# Altium project COMRAD_0v1.PrjPCB (part 3 of 5)

## Sheet Ethernet2_Power.SchDoc
size A4; DocumentNumber: 19; SheetNumber: 19; SheetTotal: 47
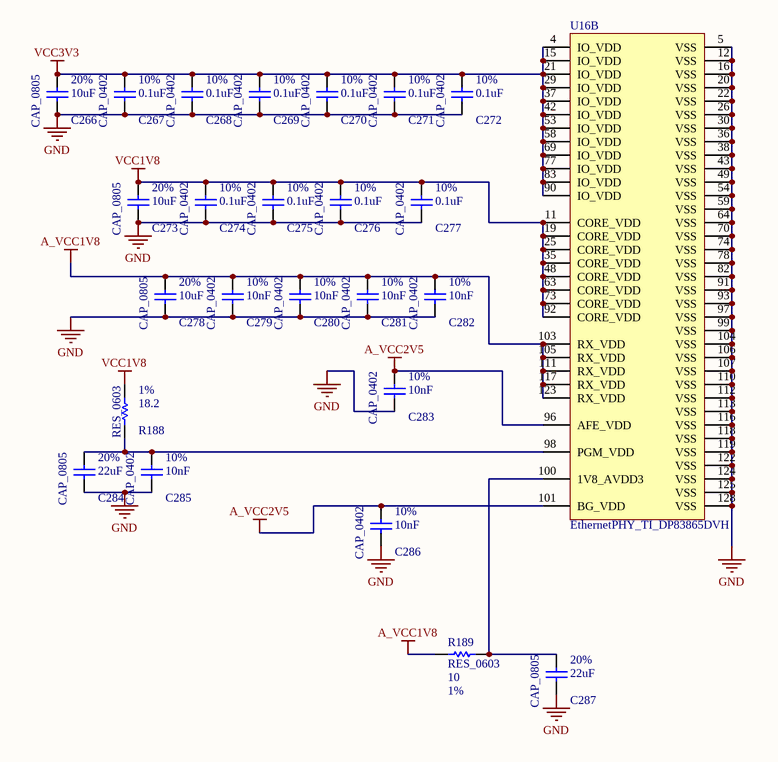
[diagram p17: Ethernet2_Power.SchDoc]

### Parts
C266  CAP_0805  value 10uF  Tolerance: 20%  [CAPC0805(2012)75_N]
C267  CAP_0402  value 0.1uF  Tolerance: 10%  [CAPC0402(1005)60_N]
C268  CAP_0402  value 0.1uF  Tolerance: 10%  [CAPC0402(1005)60_N]
C269  CAP_0402  value 0.1uF  Tolerance: 10%  [CAPC0402(1005)60_N]
C270  CAP_0402  value 0.1uF  Tolerance: 10%  [CAPC0402(1005)60_N]
C271  CAP_0402  value 0.1uF  Tolerance: 10%  [CAPC0402(1005)60_N]
C272  CAP_0402  value 0.1uF  Tolerance: 10%  [CAPC0402(1005)60_N]
C273  CAP_0805  value 10uF  Tolerance: 20%  [CAPC0805(2012)75_N]
C274  CAP_0402  value 0.1uF  Tolerance: 10%  [CAPC0402(1005)60_N]
C275  CAP_0402  value 0.1uF  Tolerance: 10%  [CAPC0402(1005)60_N]
C276  CAP_0402  value 0.1uF  Tolerance: 10%  [CAPC0402(1005)60_N]
C277  CAP_0402  value 0.1uF  Tolerance: 10%  [CAPC0402(1005)60_N]
C278  CAP_0805  value 10uF  Tolerance: 20%  [CAPC0805(2012)75_N]
C279  CAP_0402  value 10nF  Tolerance: 10%  [CAPC0402(1005)60_N]
C280  CAP_0402  value 10nF  Tolerance: 10%  [CAPC0402(1005)60_N]
C281  CAP_0402  value 10nF  Tolerance: 10%  [CAPC0402(1005)60_N]
C282  CAP_0402  value 10nF  Tolerance: 10%  [CAPC0402(1005)60_N]
C283  CAP_0402  value 10nF  Tolerance: 10%  [CAPC0402(1005)60_N]
C284  CAP_0805  value 22uF  Tolerance: 20%  [CAPC0805(2012)75_N]
C285  CAP_0402  value 10nF  Tolerance: 10%  [CAPC0402(1005)60_N]
C286  CAP_0402  value 10nF  Tolerance: 10%  [CAPC0402(1005)60_N]
C287  CAP_0805  value 22uF  Tolerance: 20%  [CAPC0805(2012)75_N]
R188  RES_0603  value 18.2  Tolerance: 1%  [RESC0603(1608)_N]
R189  RES_0603  value 10  Tolerance: 1%  [RESC0603(1608)_N]
U16  EthernetPHY_TI_DP83865DVH  [EthernetPHY_TI_DP83865(PQFP)_VLA128A_N]  (part B of 2)

### Nets
A_VCC1V8: C273.2 C274.2 C275.2 C276.2 C277.2 C278.2 C279.2 C280.2 C281.2 C282.2 R188.2 R189.2 U16.11(CORE_VDD) U16.19(CORE_VDD) U16.25(CORE_VDD) U16.35(CORE_VDD) U16.48(CORE_VDD) U16.63(CORE_VDD) U16.73(CORE_VDD) U16.92(CORE_VDD) U16.103(RX_VDD) U16.105(RX_VDD) U16.111(RX_VDD) U16.117(RX_VDD) U16.123(RX_VDD)  [also labelled VCC1V8]
A_VCC2V5: C283.2 C286.2 U16.96(AFE_VDD) U16.101(BG_VDD)
GND: C266.1 C267.1 C268.1 C269.1 C270.1 C271.1 C272.1 C273.1 C274.1 C275.1 C276.1 C277.1 C278.1 C279.1 C280.1 C281.1 C282.1 C283.1 C284.1 C285.1 C286.1 C287.1 U16.5(VSS) U16.12(VSS) U16.16(VSS) U16.20(VSS) U16.22(VSS) U16.26(VSS) U16.30(VSS) U16.36(VSS) U16.38(VSS) U16.43(VSS) U16.49(VSS) U16.54(VSS) U16.59(VSS) U16.64(VSS) U16.70(VSS) U16.74(VSS) U16.78(VSS) U16.82(VSS) U16.91(VSS) U16.93(VSS) U16.97(VSS) U16.99(VSS) U16.104(VSS) U16.106(VSS) U16.107(VSS) U16.110(VSS) U16.112(VSS) U16.113(VSS) U16.116(VSS) U16.118(VSS) U16.119(VSS) U16.122(VSS) U16.124(VSS) U16.125(VSS) U16.128(VSS)
VCC3V3: C266.2 C267.2 C268.2 C269.2 C270.2 C271.2 C272.2 U16.4(IO_VDD) U16.15(IO_VDD) U16.21(IO_VDD) U16.29(IO_VDD) U16.37(IO_VDD) U16.42(IO_VDD) U16.53(IO_VDD) U16.58(IO_VDD) U16.69(IO_VDD) U16.77(IO_VDD) U16.83(IO_VDD) U16.90(IO_VDD)
NetC284_2: C284.2 C285.2 R188.1 U16.98(PGM_VDD)
NetC287_2: C287.2 R189.1 U16.100(1V8_AVDD3)

### Library data of the parts
C266 C273 C278 = ECJ-2FB0J106M: 10uF, ceramic, 20%, 6.3V, X5R 0805; Manufacturer: Panasonic - ECG; Part Number: ECJ-2FB0J106M; Footprint Ref: CAPC0805(2012)75_N; Library Ref: CAP_0805
C267-C272 C274-C277 = CAP_0402: as C241-C246 on sheet Ethernet1_Power; Footprint Ref: CAPC0402(1005)60_N; Library Ref: CAP_0402
C279-C283 C285 C286 = CAP_0402: as C253-C257 on sheet Ethernet1_Power; Footprint Ref: CAPC0402(1005)60_N; Library Ref: CAP_0402
C284 C287 = JMK212BJ226MG-T: 22uF, ceramic, 20%, 6.3V, X5R, 0805; Manufacturer: Taiyo Yuden; Part Number: JMK212BJ226MG-T; Footprint Ref: CAPC0805(2012)75_N; Library Ref: CAP_0805
R188 = ERJ-3EKF18R2V: RES 18.2 OHM 1/10W 1% 0603 SMD; Manufacturer: Panasonic Electronics Components; Part Number: ERJ-3EKF18R2V; Footprint Ref: RESC0603(1608)_N; Library Ref: RES_0603
R189 = ERJ-3EKF10R0V: RES 10.0 OHM 1/10W 1% 0603 SMD; Manufacturer: Panasonic Electronics Components; Part Number: ERJ-3EKF10R0V; Footprint Ref: RESC0603(1608)_N; Library Ref: RES_0603
U16 = DP83865DVH: Ethernet PHY_TI_DP83865DVH, Gigabit Ethernet PHYTER,128 Lead Plastic Flat Pack; Manufacturer: Texas Instruments; Part Number: DP83865DVH

## Sheet PERIPHERALS.SchDoc
size A4; DocumentNumber: 43; SheetNumber: 43; SheetTotal: 47
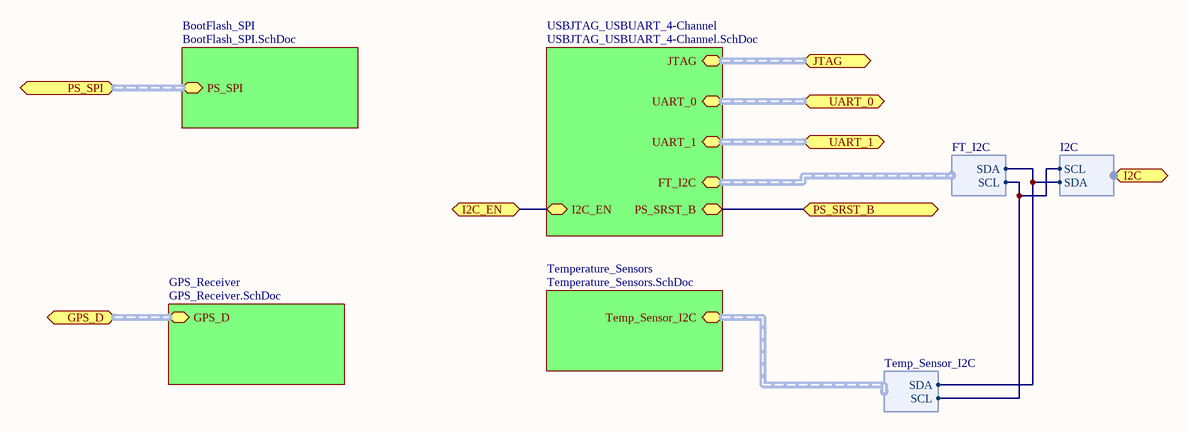
[diagram p18: PERIPHERALS.SchDoc]

### Sub-sheets
BootFlash_SPI = BootFlash_SPI.SchDoc: PS_SPI (harness SPI)
GPS_Receiver = GPS_Receiver.SchDoc: GPS_D (harness GPS)
Temperature_Sensors = Temperature_Sensors.SchDoc: Temp_Sensor_I2C (harness Temp_Sensor_I2C)
USBJTAG_USBUART_4-Channel = USBJTAG_USBUART_4-Channel.SchDoc: JTAG (harness JTAG), UART_0 (harness UART_0), UART_1 (harness UART_1), PS_SRST_B (bidir), FT_I2C (harness FT_I2C), I2C_EN

### Ports
GPS_D (harness GPS), I2C (harness I2C), I2C_EN (bidir), JTAG (harness JTAG), PS_SPI (harness SPI), PS_SRST_B (bidir), UART_0 (harness UART_0), UART_1 (harness UART_1)

### Harnesses
I2C: SCL, SDA
Temp_Sensor_I2C: SCL, SDA
FT_I2C: SCL, SDA

### Nets
I2C_EN: port I2C_EN, sheet USBJTAG_USBUART_4-Channel/I2C_EN
PS_SRST_B: port PS_SRST_B, sheet USBJTAG_USBUART_4-Channel/PS_SRST_B
NetJ10_5: port I2C.SDA, sheet Temperature_Sensors/Temp_Sensor_I2C.SDA, sheet USBJTAG_USBUART_4-Channel/FT_I2C.SDA
NetJ10_6: port I2C.SCL, sheet Temperature_Sensors/Temp_Sensor_I2C.SCL, sheet USBJTAG_USBUART_4-Channel/FT_I2C.SCL

### Buses and harness runs
harness port GPS_D = sheet GPS_Receiver/GPS_D
harness port JTAG = sheet USBJTAG_USBUART_4-Channel/JTAG
harness port PS_SPI = sheet BootFlash_SPI/PS_SPI
harness port UART_0 = sheet USBJTAG_USBUART_4-Channel/UART_0
harness port UART_1 = sheet USBJTAG_USBUART_4-Channel/UART_1

## Sheet BootFlash_SPI.SchDoc
size A4; DocumentNumber: 12; SheetNumber: 12; SheetTotal: 47
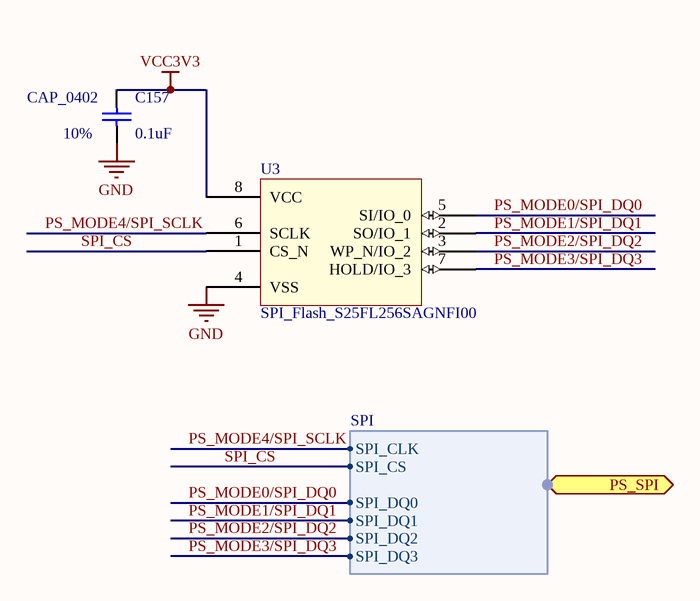
[diagram p19: BootFlash_SPI.SchDoc]

### Parts
C157  CAP_0402  value 0.1uF  Tolerance: 10%  [CAPC0402(1005)60_N]
U3  SPI_Flash_S25FL256SAGNFI00  [SPI_Flash_S25FL256SAGNFI00_WSON-8]

### Ports
PS_SPI (harness SPI)

### Harnesses
SPI: SPI_CLK, SPI_CS, SPI_DQ0, SPI_DQ1, SPI_DQ2, SPI_DQ3

### Nets
GND: C157.1 U3.4(VSS)
VCC3V3: C157.2 U3.8(VCC)
PS_MODE0/SPI_DQ0: U3.5(SI/IO_0) ; port PS_SPI.SPI_DQ0
PS_MODE1/SPI_DQ1: U3.2(SO/IO_1) ; port PS_SPI.SPI_DQ1
PS_MODE2/SPI_DQ2: U3.3(WP_N/IO_2) ; port PS_SPI.SPI_DQ2
PS_MODE3/SPI_DQ3: U3.7(HOLD/IO_3) ; port PS_SPI.SPI_DQ3
PS_MODE4/SPI_SCLK: U3.6(SCLK) ; port PS_SPI.SPI_CLK
SPI_CS: U3.1(CS_N) ; port PS_SPI.SPI_CS

### Library data of the parts
C157 = C1005X5R0J104K: 0.1uf, ceramic, 10%, 6.3V, X5R, 0402; Manufacturer: TDK Corporation; Part Number: C1005X5R0J104K; Footprint Ref: CAPC0402(1005)60_N; Library Ref: CAP_0402
U3 = S25FL256SAGNFI001: S25FL256SAGMFI00, Serial Flash Memory, 256Mbit, Low Voltage, 104MHz SPI Bus Interface, SOIC16 WIDE; Manufacturer: Spansion; Part Number: S25FL256SAGNFI001

## Sheet GPS_Receiver.SchDoc
size A4; DocumentNumber: 16; SheetNumber: 16; SheetTotal: 47
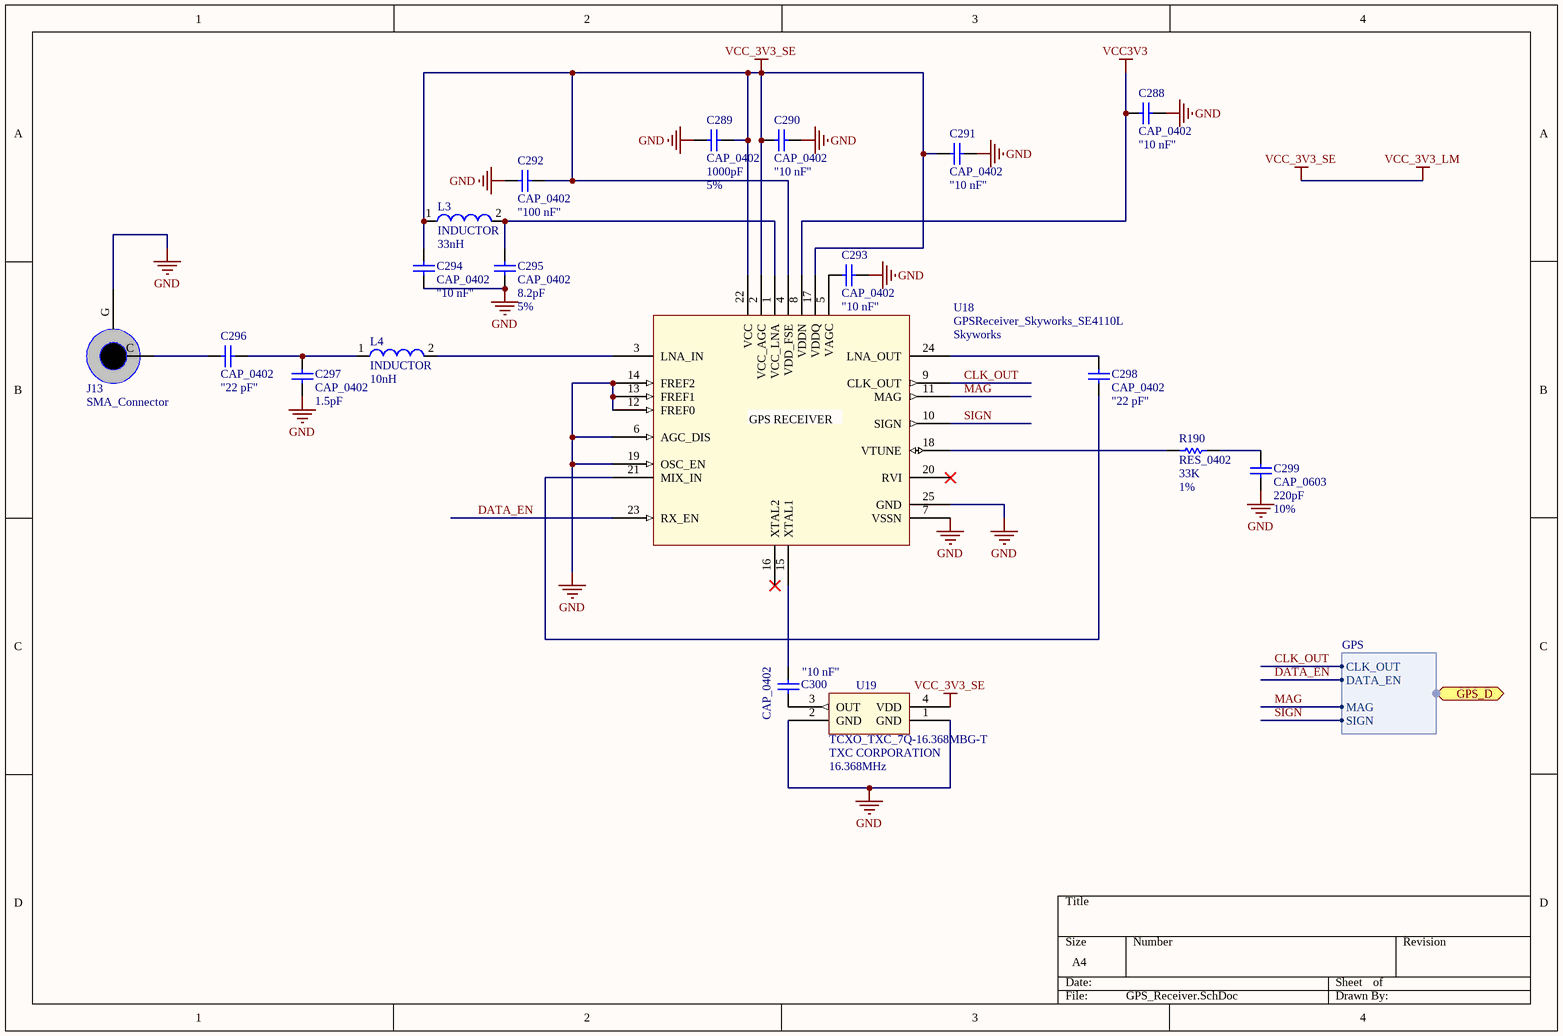
[diagram p20: GPS_Receiver.SchDoc]

### Parts
C288  CAP_0402  value "10 nF"  [CAPC0402(1005)60_N]
C289  CAP_0402  value 1000pF  Tolerance: 5%  [CAPC0402(1005)60_N]
C290  CAP_0402  value "10 nF"  [CAPC0402(1005)60_N]
C291  CAP_0402  value "10 nF"  [CAPC0402(1005)60_N]
C292  CAP_0402  value "100 nF"  [CAPC0402(1005)60_N]
C293  CAP_0402  value "10 nF"  [CAPC0402(1005)60_N]
C294  CAP_0402  value "10 nF"  [CAPC0402(1005)60_N]
C295  CAP_0402  value 8.2pF  Tolerance: 5%  [CAPC0402(1005)60_N]
C296  CAP_0402  value "22 pF"  [CAPC0402(1005)60_N]
C297  CAP_0402  value 1.5pF  [CAPC0402(1005)60_N]
C298  CAP_0402  value "22 pF"  [CAPC0402(1005)60_N]
C299  CAP_0603  value 220pF  Tolerance: 10%  [CAPC0603(1608)100_N]
C300  CAP_0402  value "10 nF"  [CAPC0402(1005)60_N]
J13  SMA_Connector  [Connector_SMA_Amphenol_132255_Edgemount]
L3  INDUCTOR  value 33nH  [Inductor0402(1005)]
L4  INDUCTOR  value 10nH  [Inductor0402(1005)]
R190  RES_0402  value 33K  Tolerance: 1%  [RESC0402(1005)_N]
U18  GPSReceiver_Skyworks_SE4110L  Manufacturer: Skyworks  [GPSReceiver_Skyworks_SE4110L_24QFN]
U19  TCXO_TXC_7Q-16.368MBG-T  value 16.368MHz  Manufacturer: TXC CORPORATION  [TCXO_TXC_7Q-16.368MBG-T_4-PIN]

### Ports
GPS_D (harness GPS)

### Harnesses
GPS: CLK_OUT, DATA_EN, MAG, SIGN

### Nets
GND: C288.2 C289.1 C290.1 C291.1 C292.2 C293.1 C294.2 C295.1 C297.1 C299.1 J13.G U18.6(AGC_DIS) U18.7(VSSN) U18.12(FREF0) U18.13(FREF1) U18.14(FREF2) U18.19(OSC_EN) U18.25(GND) U19.1(GND) U19.2(GND)
VCC3V3: C288.1 U18.8(VDDN)
VCC_3V3_LM: C289.2 C290.2 C291.2 C292.1 C294.1 L3.1 U18.2(VCC_AGC) U18.4(VDD_FSE) U18.17(VDDQ) U18.22(VCC) U19.4(VDD)  [also labelled VCC_3V3_SE]
CLK_OUT: U18.9(CLK_OUT) ; port GPS_D.CLK_OUT
DATA_EN: U18.23(RX_EN) ; port GPS_D.DATA_EN
MAG: U18.11(MAG) ; port GPS_D.MAG
SIGN: U18.10(SIGN) ; port GPS_D.SIGN
NetC293_2: C293.2 U18.5(VAGC)
NetC295_2: C295.2 L3.2 U18.1(VCC_LNA)
NetC296_1: C296.1 J13.C
NetC296_2: C296.2 C297.2 L4.1
NetC298_1: C298.1 U18.21(MIX_IN)
NetC298_2: C298.2 U18.24(LNA_OUT)
NetC299_2: C299.2 R190.2
NetC300_1: C300.1 U19.3(OUT)
NetC300_2: C300.2 U18.15(XTAL1)
NetL4_2: L4.2 U18.3(LNA_IN)
NetR190_1: R190.1 U18.18(VTUNE)

Not connected (* = marked no-connect by the designer): U18 16(XTAL2)* 20(RVI)*

### Notes on the sheet
- (in symbol SE4110L) GPS RECEIVER

### Library data of the parts
C288 C290 C291 C293 C294 C300 = "2238 787 15636": C 10 nF 16 V 0402 X7R; Manufacturer: PHYCOMP; Tolerance: *; Part Number: "2238 787 15636"; Footprint Ref: CAPC0402(1005)60_N; Library Ref: CAP_0402
C289 = TMK105SD102JV-F: CAP CER 1000PF 25V 5% 0402; Manufacturer: Taiyo Yuden; Part Number: TMK105SD102JV-F; Footprint Ref: CAPC0402(1005)60_N; Library Ref: CAP_0402
C292 = "C0402C104K8PAC": C 100 nF 16 V 0402 X5R; Manufacturer: KEMET; Tolerance: *; Part Number: "C0402C104K8PAC"; Footprint Ref: CAPC0402(1005)60_N; Library Ref: CAP_0402
C295 = C0402C829J3GACAUTO: CAP CER 8.2PF 25V 5% NP0 0402; Manufacturer: Kemet; Part Number: C0402C829J3GACAUTO; Footprint Ref: CAPC0402(1005)60_N; Library Ref: CAP_0402
C296 C298 = "GRM1555C1H220JZ01D": C 22 pF 50 V 0402 NP0; Manufacturer: MURATA; Tolerance: *; Part Number: "GRM1555C1H220JZ01D"; Footprint Ref: CAPC0402(1005)60_N; Library Ref: CAP_0402
C297 = GJM1555C1H1R5CB01D: CAP CER 1.5PF 50V NP0 0402; Manufacturer: Murata Electronics North America; Tolerance: *; Part Number: GJM1555C1H1R5CB01D; Footprint Ref: CAPC0402(1005)60_N; Library Ref: CAP_0402
C299 = VJ0603D221KXAAJ: CAP CER 220PF 50V 10% NP0 0603; Manufacturer: Vishay Vitramon; Part Number: VJ0603D221KXAAJ; Footprint Ref: CAPC0603(1608)100_N; Library Ref: CAP_0603
J13 = 132255: CONN RCPT SMA END LAUNCH PCB; Part Number: 132255; Manufacturer: Amphenol Connex
L3 = 0402AF-330: INDUCTOR, 33nH, 0402, DCR 0.06,; Manufacturer: Coilcraft; Tolerance: *; Part Number: 0402AF-330; Library Ref: INDUCTOR; Footprint Ref: Inductor0402(1005)
L4 = 0402CS-10N: INDUCTOR, 10nH, 0402, DCR 0.2,; Manufacturer: Coilcraft; Tolerance: *; Part Number: 0402CS-10N; Library Ref: INDUCTOR; Footprint Ref: Inductor0402(1005)
R190 = RK73H1ETTP3302F: 33K ohms, 1% 1/16W, 0402; Manufacturer: KOA Speer Electronics; Part Number: RK73H1ETTP3302F; Footprint Ref: RESC0402(1005)_N; Library Ref: RES_0402
U18 = SE4110L: High sensitivity / low power GPS and A-GPS,10 mA operating current with 2.7-3.3 V supply; Part Number: SE4110L; Library Ref: GPSReceiver_Skyworks_SE4110L; Footprint Ref: GPSReceiver_Skyworks_SE4110L_24QFN
U19 = 7Q-16.368MBG-T: OSC TCXO 16.368 MHZ 3.3V SMD; Part Number: 7Q-16.368MBG-T; Footprint Ref: TCXO_TXC_7Q-16.368MBG-T_4-PIN; Library Ref: TCXO_TXC_7Q-16.368MBG-T

## Sheet USBJTAG_USBUART_4-Channel.SchDoc
size A3; DocumentNumber: 47; SheetNumber: 47; SheetTotal: 47
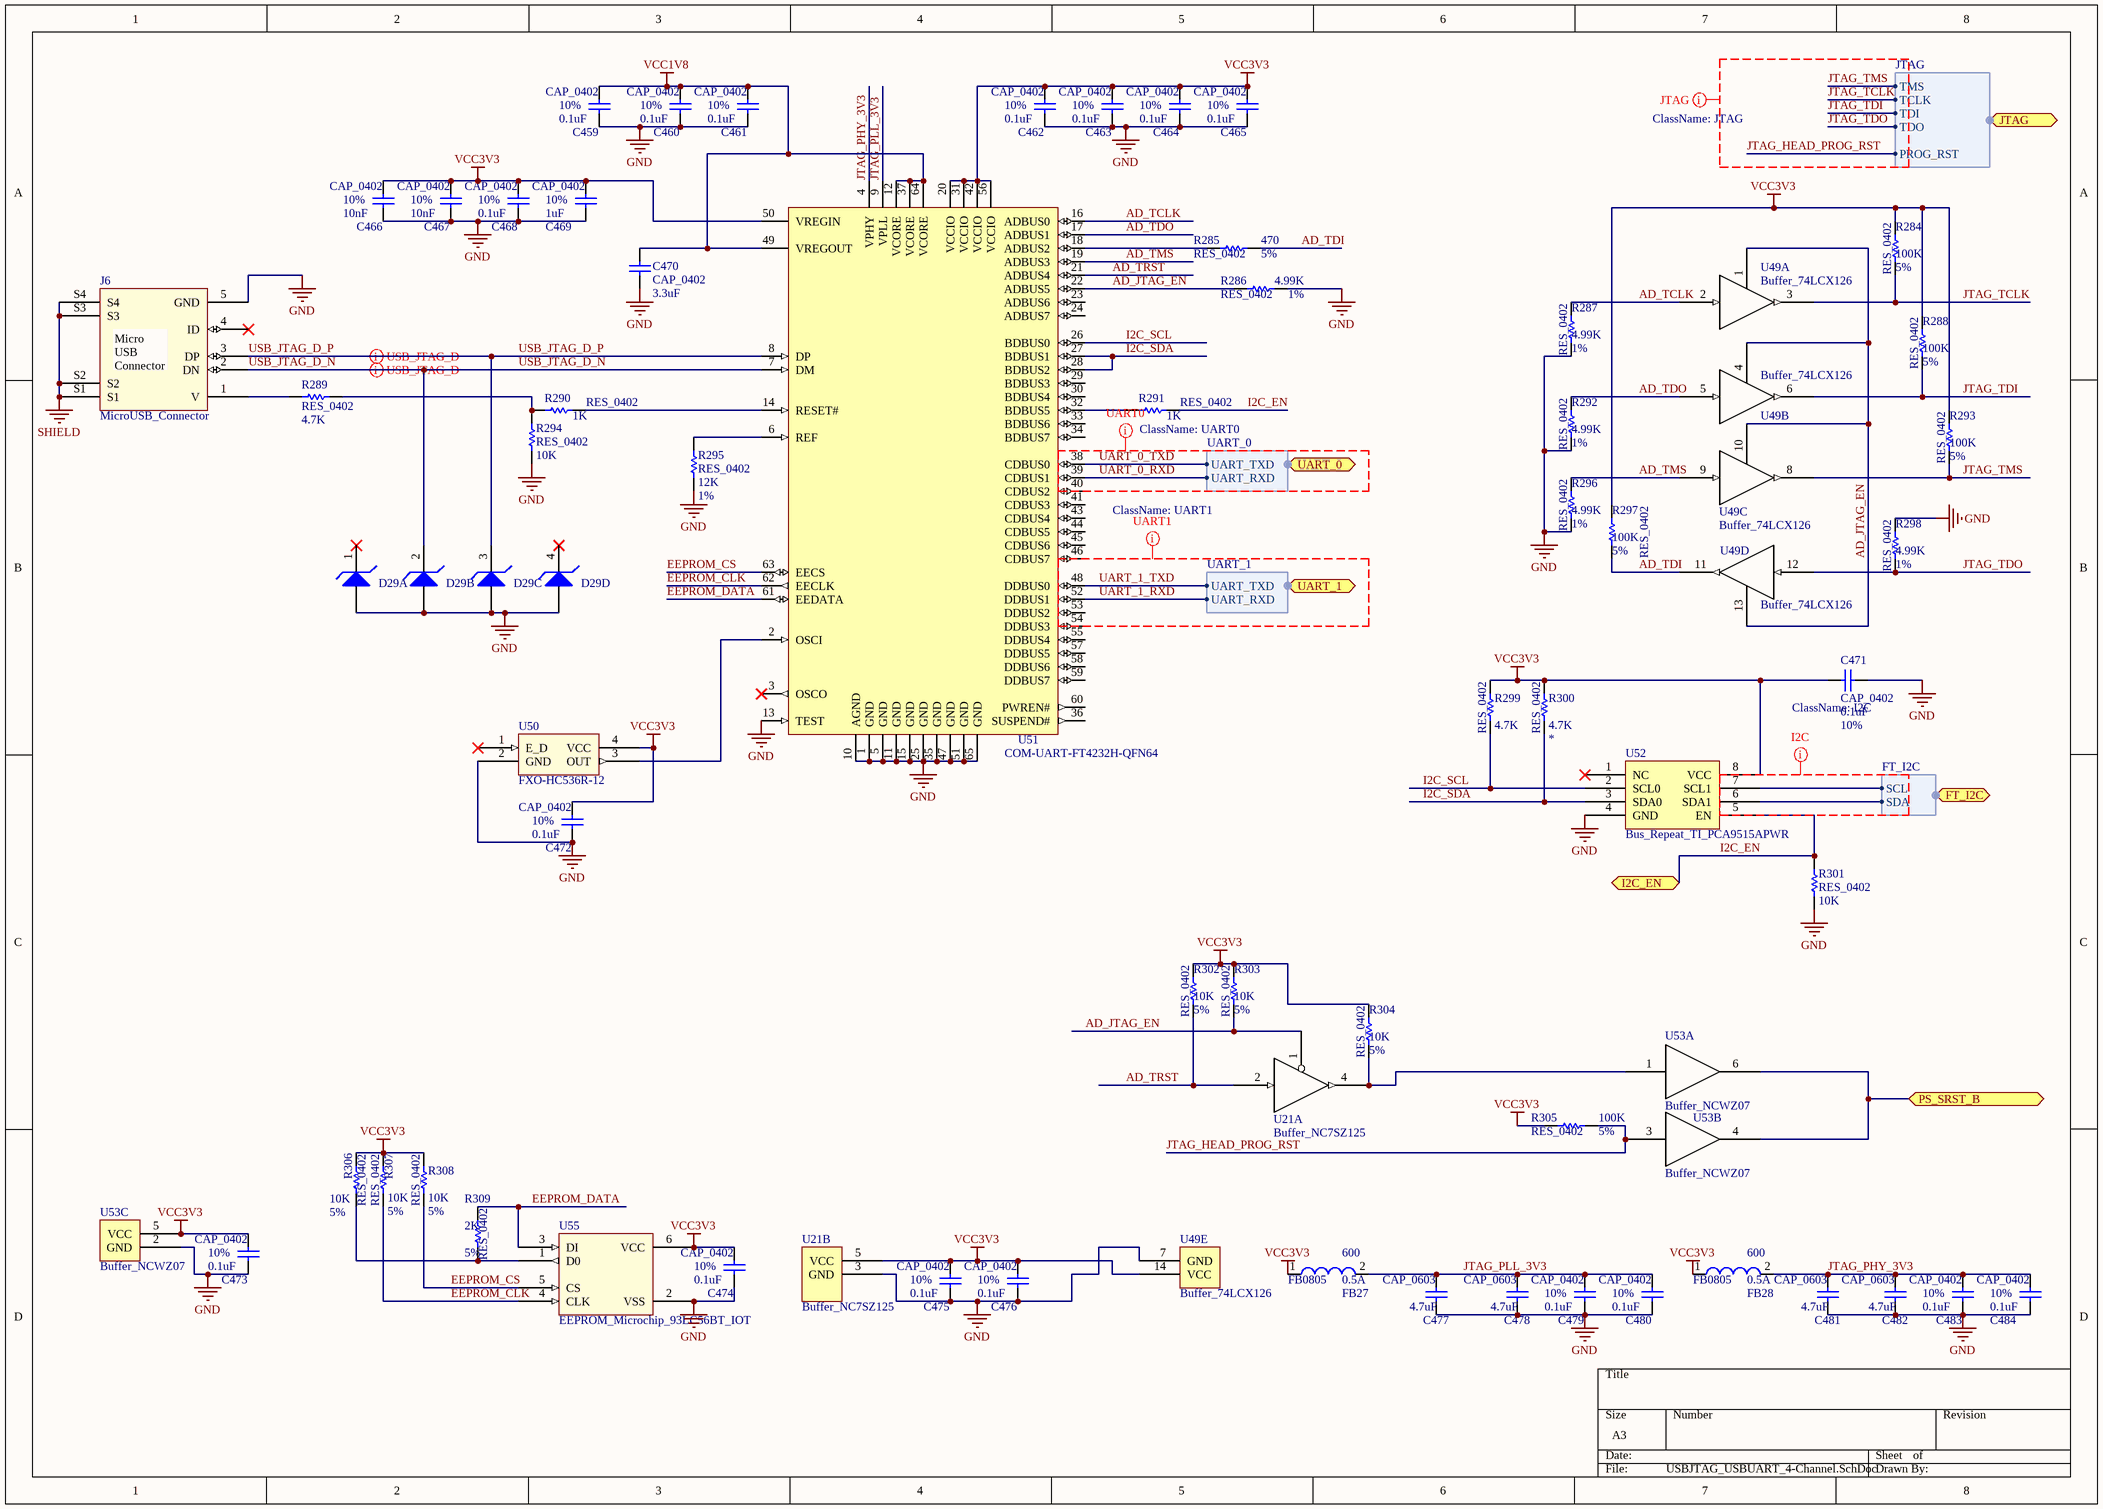
[diagram p21: USBJTAG_USBUART_4-Channel.SchDoc]

### Parts
C459  CAP_0402  value 0.1uF  Tolerance: 10%  [CAPC0402(1005)60_N]
C460  CAP_0402  value 0.1uF  Tolerance: 10%  [CAPC0402(1005)60_N]
C461  CAP_0402  value 0.1uF  Tolerance: 10%  [CAPC0402(1005)60_N]
C462  CAP_0402  value 0.1uF  Tolerance: 10%  [CAPC0402(1005)60_N]
C463  CAP_0402  value 0.1uF  Tolerance: 10%  [CAPC0402(1005)60_N]
C464  CAP_0402  value 0.1uF  Tolerance: 10%  [CAPC0402(1005)60_N]
C465  CAP_0402  value 0.1uF  Tolerance: 10%  [CAPC0402(1005)60_N]
C466  CAP_0402  value 10nF  Tolerance: 10%  [CAPC0402(1005)60_N]
C467  CAP_0402  value 10nF  Tolerance: 10%  [CAPC0402(1005)60_N]
C468  CAP_0402  value 0.1uF  Tolerance: 10%  [CAPC0402(1005)60_N]
C469  CAP_0402  value 1uF  Tolerance: 10%  [CAPC0402(1005)60_N]
C470  CAP_0402  value 3.3uF  [CAPC0402(1005)60_N]
C471  CAP_0402  value 0.1uF  Tolerance: 10%  [CAPC0402(1005)60_N]
C472  CAP_0402  value 0.1uF  Tolerance: 10%  [CAPC0402(1005)60_N]
C473  CAP_0402  value 0.1uF  Tolerance: 10%  [CAPC0402(1005)60_N]
C474  CAP_0402  value 0.1uF  Tolerance: 10%  [CAPC0402(1005)60_N]
C475  CAP_0402  value 0.1uF  Tolerance: 10%  [CAPC0402(1005)60_N]
C476  CAP_0402  value 0.1uF  Tolerance: 10%  [CAPC0402(1005)60_N]
C477  CAP_0603  value 4.7uF  [CAPC0603(1608)100_N]
C478  CAP_0603  value 4.7uF  [CAPC0603(1608)100_N]
C479  CAP_0402  value 0.1uF  Tolerance: 10%  [CAPC0402(1005)60_N]
C480  CAP_0402  value 0.1uF  Tolerance: 10%  [CAPC0402(1005)60_N]
C481  CAP_0603  value 4.7uF  [CAPC0603(1608)100_N]
C482  CAP_0603  value 4.7uF  [CAPC0603(1608)100_N]
C483  CAP_0402  value 0.1uF  Tolerance: 10%  [CAPC0402(1005)60_N]
C484  CAP_0402  value 0.1uF  Tolerance: 10%  [CAPC0402(1005)60_N]
D29  QuadESDDiode_TEConnectivity_SESD0802Q4UG  [QuadESDDiode_TEConnectivity_SESD0802Q4UG_5-PIN]  (value not drawn)  (parts A,B,C,D of 4)
FB27  FB0805  Resistance: 600  Max_Current: 0.5A  [Inductor0805(2012)]
FB28  FB0805  Resistance: 600  Max_Current: 0.5A  [Inductor0805(2012)]
J6  MicroUSB_Connector  [MicroUSB_ConnReceptacle_Hirose_ZX62-B-5PA(11)_pcb]
R284  RES_0402  value 100K  Tolerance: 5%  [RESC0402(1005)_N]
R285  RES_0402  value 470  Tolerance: 5%  [RESC0402(1005)_N]
R286  RES_0402  value 4.99K  Tolerance: 1%  [RESC0402(1005)_N]
R287  RES_0402  value 4.99K  Tolerance: 1%  [RESC0402(1005)_N]
R288  RES_0402  value 100K  Tolerance: 5%  [RESC0402(1005)_N]
R289  RES_0402  value 4.7K  [RESC0402(1005)_N]
R290  RES_0402  value 1K  [RESC0402(1005)_N]
R291  RES_0402  value 1K  [RESC0402(1005)_N]
R292  RES_0402  value 4.99K  Tolerance: 1%  [RESC0402(1005)_N]
R293  RES_0402  value 100K  Tolerance: 5%  [RESC0402(1005)_N]
R294  RES_0402  value 10K  [RESC0402(1005)_N]
R295  RES_0402  value 12K  Tolerance: 1%  [RESC0402(1005)_N]
R296  RES_0402  value 4.99K  Tolerance: 1%  [RESC0402(1005)_N]
R297  RES_0402  value 100K  Tolerance: 5%  [RESC0402(1005)_N]
R298  RES_0402  value 4.99K  Tolerance: 1%  [RESC0402(1005)_N]
R299  RES_0402  value 4.7K  [RESC0402(1005)_N]
R300  RES_0402  value 4.7K  [RESC0402(1005)_N]
R301  RES_0402  value 10K  [RESC0402(1005)_N]
R302  RES_0402  value 10K  Tolerance: 5%  [RESC0402(1005)_N]
R303  RES_0402  value 10K  Tolerance: 5%  [RESC0402(1005)_N]
R304  RES_0402  value 10K  Tolerance: 5%  [RESC0402(1005)_N]
R305  RES_0402  value 100K  Tolerance: 5%  [RESC0402(1005)_N]
R306  RES_0402  value 10K  Tolerance: 5%  [RESC0402(1005)_N]
R307  RES_0402  value 10K  Tolerance: 5%  [RESC0402(1005)_N]
R308  RES_0402  value 10K  Tolerance: 5%  [RESC0402(1005)_N]
R309  RES_0402  value 2K  Tolerance: 5%  [RESC0402(1005)_N]
U21  Buffer_NC7SZ125  [Buffer_Fairchild_NC7SZ125_SOT95P280X145-5N]  (parts A,B of 2)
U49  Buffer_74LCX126  [Buffer_Fairchild_74LCX126_DQFN-14]  (parts A,B,C,D,E of 5)
U50  FXO-HC536R-12  [Oscillator_Fox_767-12-69_HC5]
U51  COM-UART-FT4232H-QFN64  [FTDI_FT4232HQ_QFN64_2_N]
U52  Bus_Repeat_TI_PCA9515APWR  [Bus_Repeat_TI_PCA9515APWR_8-TSSOP]
U53  Buffer_NCWZ07  [Buffer_Fairchild_NCWZ07_SC70-6]  (parts A,B,C of 3)
U55  EEPROM_Microchip_93LC56BT_IOT  [EEPROM_Microchip_93LC56BT_IOT_SOT23-6]

### Ports
FT_I2C (harness FT_I2C), I2C_EN, JTAG (harness JTAG), PS_SRST_B (bidir), UART_0 (harness UART_0), UART_1 (harness UART_1)

### Harnesses
JTAG: TMS, TCLK, TDI, TDO, PROG_RST
UART_0: UART_TXD, UART_RXD
UART_1: UART_TXD, UART_RXD
FT_I2C: SCL, SDA

### Nets
GND: C459.1 C460.1 C461.1 C462.1 C463.1 C464.1 C465.1 C466.1 C467.1 C468.1 C469.1 C470.1 C471.1 C472.1 C473.1 C474.1 C475.1 C476.1 C477.1 C478.1 C479.1 C480.1 C481.1 C482.1 C483.1 C484.1 D29.G(A) J6.5(GND) R286.2 R287.1 R292.1 R294.1 R295.1 R296.1 R298.2 R301.1 U21.3(GND) U49.7(GND) U50.2(GND) U51.1(GND) U51.5(GND) U51.10(AGND) U51.11(GND) U51.13(TEST) U51.15(GND) U51.25(GND) U51.35(GND) U51.47(GND) U51.51(GND) U51.65(GND) U52.4(GND) U53.2(GND) U55.2(VSS)
SHIELD: J6.S1 J6.S2 J6.S3 J6.S4
VCC1V8: C459.2 C460.2 C461.2 C470.2 U51.12(VCORE) U51.37(VCORE) U51.49(VREGOUT) U51.64(VCORE)  [project net A_VCC1V8]
VCC3V3: C462.2 C463.2 C464.2 C465.2 C466.2 C467.2 C468.2 C469.2 C471.2 C472.2 C473.2 C474.2 C475.2 C476.2 FB27.1 FB28.1 R284.2 R288.2 R293.2 R297.2 R299.2 R300.2 R302.2 R303.2 R304.2 R305.2 R306.2 R307.2 R308.2 U21.5(VCC) U49.14(VCC) U50.4(VCC) U51.20(VCCIO) U51.31(VCCIO) U51.42(VCCIO) U51.50(VREGIN) U51.56(VCCIO) U52.8(VCC) U53.5(VCC) U55.6(VCC)
AD_JTAG_EN: R286.1 R303.1 U21.1 U49.1 U49.4 U49.10 U49.13 U51.22(ADBUS5)
AD_TCLK: R287.2 U49.2 U51.16(ADBUS0)
AD_TDI: R285.2 R297.1 U49.11
AD_TDO: R292.2 U49.5 U51.17(ADBUS1)
AD_TMS: R296.2 U49.9 U51.19(ADBUS3)
AD_TRST: R302.1 U21.2 U51.21(ADBUS4)
EEPROM_CLK: R307.1 U51.62(EECLK) U55.4(CLK)
EEPROM_CS: R308.1 U51.63(EECS) U55.5(CS)
EEPROM_DATA: R309.2 U51.61(EEDATA) U55.3(DI)
I2C_EN: R291.2 R301.2 U52.5(EN) ; port I2C_EN
I2C_SCL: R299.1 U51.26(BDBUS0) U52.2(SCL0)
I2C_SDA: R300.1 U51.27(BDBUS1) U51.28(BDBUS2) U52.3(SDA0)
JTAG_HEAD_PROG_RST: R305.1 U53.3 ; port JTAG.PROG_RST
JTAG_PHY_3V3: C481.2 C482.2 C483.2 C484.2 FB28.2 U51.4(VPHY)
JTAG_PLL_3V3: C477.2 C478.2 C479.2 C480.2 FB27.2 U51.9(VPLL)
JTAG_TCLK: R284.1 U49.3 ; port JTAG.TCLK
JTAG_TDI: R288.1 U49.6 ; port JTAG.TDI
JTAG_TDO: R298.1 U49.12 ; port JTAG.TDO
JTAG_TMS: R293.1 U49.8 ; port JTAG.TMS
PS_SRST_B: U53.4 U53.6 ; port PS_SRST_B
UART_0_RXD: U51.39(CDBUS1) ; port UART_0.UART_RXD
UART_0_TXD: U51.38(CDBUS0) ; port UART_0.UART_TXD
UART_1_RXD: U51.52(DDBUS1) ; port UART_1.UART_RXD
UART_1_TXD: U51.48(DDBUS0) ; port UART_1.UART_TXD
USB_JTAG_D_N: D29.2(K) J6.2(DN) U51.7(DM)
USB_JTAG_D_P: D29.3(K) J6.3(DP) U51.8(DP)
NetJ6_1: J6.1(V) R289.1
NetJ10_5: U52.6(SDA1) ; port FT_I2C.SDA
NetJ10_6: U52.7(SCL1) ; port FT_I2C.SCL
NetR285_1: R285.1 U51.18(ADBUS2)
NetR289_2: R289.2 R290.1 R294.2
NetR290_2: R290.2 U51.14(RESET#)
NetR291_1: R291.1 U51.32(BDBUS5)
NetR295_2: R295.2 U51.6(REF)
NetR304_1: R304.1 U21.4 U53.1
NetR306_1: R306.1 R309.1 U55.1(D0)
NetU50_3: U50.3(OUT) U51.2(OSCI)

Not connected (* = marked no-connect by the designer): D29 1(K)* 4(K)*; J6 4(ID)*; U50 1(E_D)*; U51 3(OSCO)* 23(ADBUS6) 24(ADBUS7) 29(BDBUS3) 30(BDBUS4) 33(BDBUS6) 34(BDBUS7) 36(SUSPEND#) 40(CDBUS2) 41(CDBUS3) 43(CDBUS4) 44(CDBUS5) 45(CDBUS6) 46(CDBUS7) 53(DDBUS2) 54(DDBUS3) 55(DDBUS4) 57(DDBUS5) 58(DDBUS6) 59(DDBUS7) 60(PWREN#); U52 1(NC)*

### Layout directives
differential pair: USB_JTAG_D_N, USB_JTAG_D_P
net class UART1: UART_1_RXD, UART_1_TXD
net class UART0: UART_0_RXD, UART_0_TXD
net class I2C: (no net found under the mark)
net class JTAG: JTAG_HEAD_PROG_RST, JTAG_TCLK, JTAG_TDI, JTAG_TDO, JTAG_TMS

### Notes on the sheet
- (in symbol ZX62-B-5PA(11)) Micro USB / Connector

### Library data of the parts
C459-C465 C468 C471-C476 C479 C480 C483 C484 = CAP_0402: as C241-C246 on sheet Ethernet1_Power; Footprint Ref: CAPC0402(1005)60_N; Library Ref: CAP_0402
C466 C467 = CAP_0402: as C253-C257 on sheet Ethernet1_Power; Footprint Ref: CAPC0402(1005)60_N; Library Ref: CAP_0402
C469 = CAP_0402: 1uF, ceramic, 10%, 6.3V, X5R, 0402; Part Number: C1005X5R0J105K; Manufacturer: TDK Corporation; Footprint Ref: CAPC0402(1005)60_N; Library Ref: CAP_0402
C470 = C1005X5R0J335M050BC: CAP CER 3.3UF 6.3V 20% X5R 0402; Manufacturer: TDK Corporation; Tolerance: 20%; Part Number: C1005X5R0J335M050BC
C477 C478 C481 C482 = LMK107BJ475KA-T: 4.7uF, ceramic, 10%, 10V X5R, 0603; Manufacturer: Taiyo Yuden; Tolerance: 10%; Part Number: LMK107BJ475KA-T
D29 = RF2197-000: SESD0802Q4UG, Quad Diode Array for ESD protection; Part Number: RF2197-000; Manufacturer: TE Connectivity
FB27 FB28 = FerriteBead0805: MPZ2012S601A, 600 ohm, 100MHz, 0805; Manufacturer: TDK Corporation; Value: 600; Part Number: MPZ2012S601A; Footprint Ref: Inductor0805(2012); Library Ref: FerriteBead0805
J6 = ZX62-B-5PA(11): CONN RCPT MICRO USB B SMD R/A; Manufacturer: Hirose Electric Co Ltd; Part Number: ZX62-B-5PA(11)
R284 R288 R293 R297 R305 = RES_0402: 100K ohm, 5%, 1/16W, 0402; Part Number: RC0402JR-07100KL; Manufacturer: Yageo America; Library Ref: RES_0402; Footprint Ref: RESC0402(1005)_N
R285 = RES_0402: 470 ohm, 5%, 1/16W, 0402; Part Number: MCR01MZPJ471; Manufacturer: ROHM; Library Ref: RES_0402; Footprint Ref: RESC0402(1005)_N
R286 R287 R292 R296 R298 = RES_0402: 4.99K ohm, 1% 1/16W, 0402; Part Number: CRCW04024K99FKED; Manufacturer: Vishay/Dale; Library Ref: RES_0402; Footprint Ref: RESC0402(1005)_N
R289 R299 R300 = RC0402JR-074K7L: 4.7K ohm, 5%, 1/16W, 0402; Manufacturer: Yageo America; Part Number: RC0402JR-074K7L
  R289 R299: Tolerance: 5%
  R300: Tolerance: *
R290 R291 = RC0402JR-071KL: 1K ohm, 5%, 1/16W, 0402; Manufacturer: Yageo America; Tolerance: 5%; Part Number: RC0402JR-071KL
R294 R301 = RC0402JR-0710KL: 10K ohm, 5%, 1/16W, 0402; Manufacturer: Yageo America; Tolerance: 5%; Part Number: RC0402JR-0710KL
R295 = RES_0402: 12K ohm, 1% 1/10W, 0402; Part Number: ERJ-2RKF1202X; Manufacturer: Panasonic - ECG; Library Ref: RES_0402; Footprint Ref: RESC0402(1005)_N
R302-R304 R306-R308 = RES_0402: 10K ohm, 5%, 1/16W, 0402; Part Number: RC0402JR-0710KL; Manufacturer: Yageo America; Library Ref: RES_0402; Footprint Ref: RESC0402(1005)_N
R309 = RES_0402: 2K ohm, 5% 1/16W, 0402; Part Number: ERJ-2GEJ202X; Manufacturer: Panasonic - ECG; Library Ref: RES_0402; Footprint Ref: RESC0402(1005)_N
U21 = NC7SZ125M5X: NC7SZ125M5X, Tri-State Buffer UHS, SOT-23; Manufacturer: FAIRCHILD SEMICONDUCTOR; Part Number: NC7SZ125M5X
U49 = Buffer_74LCX126: 74LCX126BQX, quad buffer, LV N-Inv, DQFN14; Manufacturer: FAIRCHILD SEMICONDUCTOR; Part Number: 74LCX126BQX; Footprint Ref: Buffer_Fairchild_74LCX126_DQFN-14; Library Ref: Buffer_Fairchild_74LCX126
U50 = FXO-HC536R-12: 767-12-69, 12MHz 3.3V HCMOS Oscillator, HC5; Manufacturer: Fox Electronics; Part Number: FXO-HC536R-12
U51 = FT4232HQ-REEL: IC USB HS QUAD UART/SYNC 64-QFN; Manufacturer: FTDI, Future Technology Devices International Ltd; Part Number: FT4232HQ-REEL
U52 = PCA9515APWR: IC DUAL BIDIR BUS REPEAT 8-TSSOP; Manufacturer: Texas Instruments; Part Number: PCA9515APWR
U53 = NC7WZ07P6X: NC7WZ07, dual non-inverting buffer, SC-70-6 (SOT-363); Manufacturer: FAIRCHILD OPTOELECTRICS GROUP; Part Number: NC7WZ07P6X; Footprint Ref: Buffer_Fairchild_NCWZ07_SC70-6; Library Ref: Buffer_Fairchild_NCWZ07
U55 = EEPROM_Microchip_93LC56BT_IOT: 93LC56BT-I/OT, EEPROM 2Kbit 3MHz, SOT23-6; Manufacturer: Microchip Technology; Part Number: 93LC56BT-I/OT; Footprint Ref: EEPROM_Microchip_93LC56BT_IOT_SOT23-6; Library Ref: EEPROM_Microchip_93LC56BT_IOT

## Sheet Temperature_Sensors.SchDoc
size A4
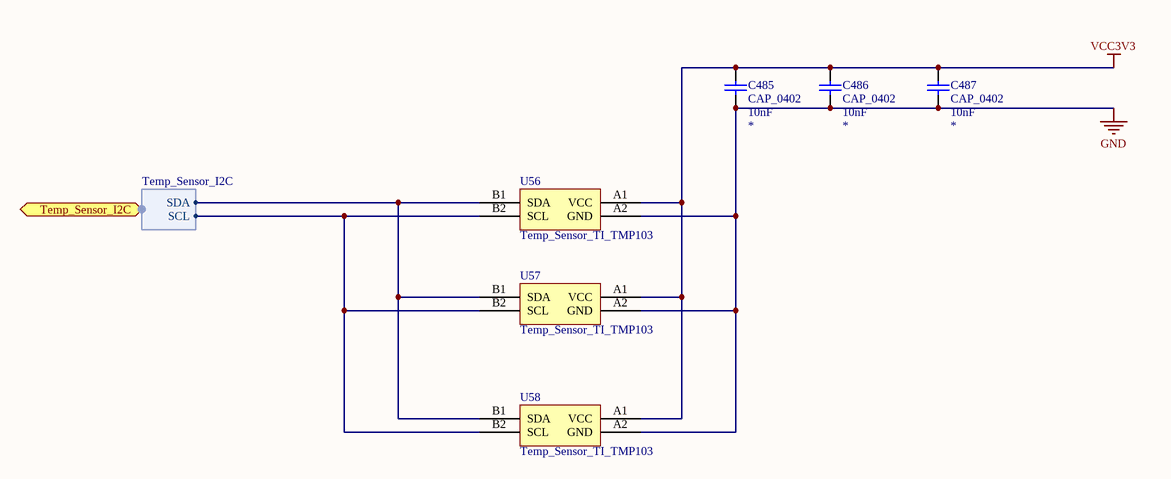
[diagram p22: Temperature_Sensors.SchDoc]

### Parts
C485  CAP_0402  value 10nF  [CAPC0402(1005)60_N]
C486  CAP_0402  value 10nF  [CAPC0402(1005)60_N]
C487  CAP_0402  value 10nF  [CAPC0402(1005)60_N]
U56  Temp_Sensor_TI_TMP103  [Temp_Sensor_TI_TMP103_XBGA-4]
U57  Temp_Sensor_TI_TMP103  [Temp_Sensor_TI_TMP103_XBGA-4]
U58  Temp_Sensor_TI_TMP103  [Temp_Sensor_TI_TMP103_XBGA-4]

### Ports
Temp_Sensor_I2C (harness Temp_Sensor_I2C)

### Harnesses
Temp_Sensor_I2C: SCL, SDA

### Nets
GND: C485.1 C486.1 C487.1 U56.A2(GND) U57.A2(GND) U58.A2(GND)
VCC3V3: C485.2 C486.2 C487.2 U56.A1(VCC) U57.A1(VCC) U58.A1(VCC)
NetJ10_5: U56.B1(SDA) U57.B1(SDA) U58.B1(SDA) ; port Temp_Sensor_I2C.SDA
NetJ10_6: U56.B2(SCL) U57.B2(SCL) U58.B2(SCL) ; port Temp_Sensor_I2C.SCL

### Library data of the parts
C485-C487 = GRM155R60J103KA01D: 10000pF, ceramic, 10% 6.3V X5R, 0402; Manufacturer: Murata Electronics North America; Tolerance: *; Part Number: GRM155R60J103KA01D
U56 = TMP103AYFFR: IC TEMP SENSOR DGTL SMBUS 4DSBGA, Address - A; Manufacturer: Texas Instruments; Part Number: TMP103AYFFR
U57 = TMP103BYFFR: IC TEMP SENSOR DGTL SMBUS 4DSBGA, Address - B; Manufacturer: Texas Instruments; Part Number: TMP103BYFFR
U58 = TMP103CYFFR: IC TEMP SENSOR DGTL SMBUS 4DSBGA, Address - C; Manufacturer: Texas Instruments; Part Number: TMP103CYFFR

## Sheet RF_TOP_LEVEL.SchDoc
size A4; DocumentNumber: 45; SheetNumber: 45; SheetTotal: 47
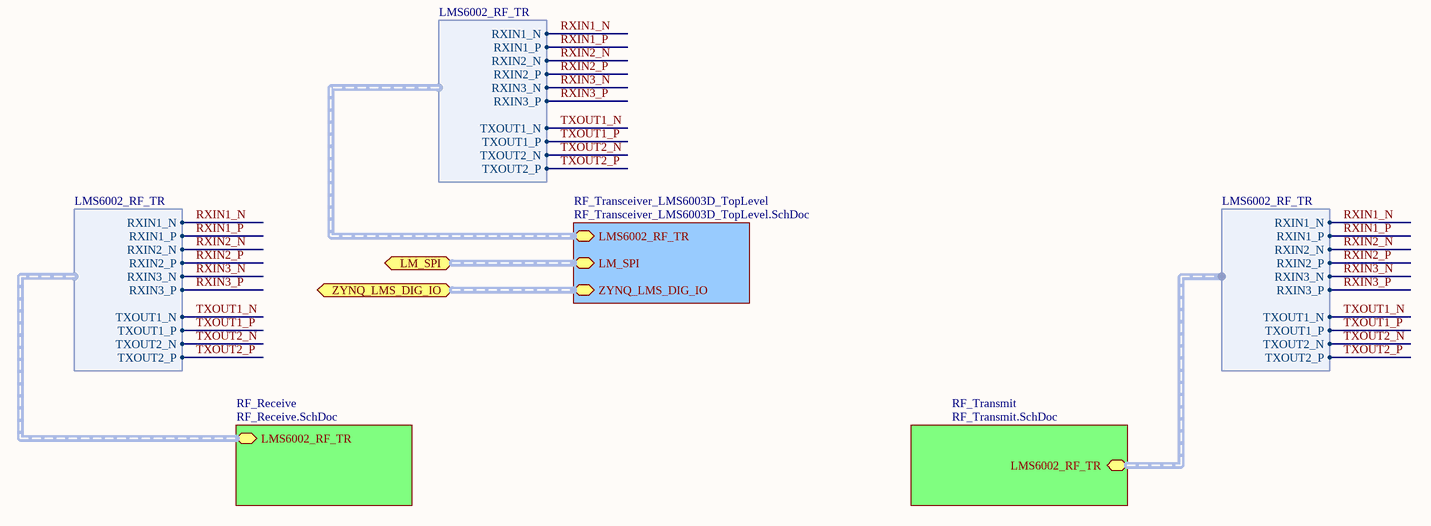
[diagram p23: RF_TOP_LEVEL.SchDoc]

### Sub-sheets
RF_Receive = RF_Receive.SchDoc: LMS6002_RF_TR (harness LMS6002_RF_TR)
RF_Transceiver_LMS6003D_TopLevel = RF_Transceiver_LMS6003D_TopLevel.SchDoc: LMS6002_RF_TR (harness LMS6002_RF_TR), LM_SPI (harness LM_SPI), ZYNQ_LMS_DIG_IO (harness DIG_IO)
RF_Transmit = RF_Transmit.SchDoc: LMS6002_RF_TR (harness LMS6002_RF_TR)

### Ports
LM_SPI (harness LM_SPI), ZYNQ_LMS_DIG_IO (harness DIG_IO)

### Harnesses
LMS6002_RF_TR: RXIN1_N, RXIN1_P, RXIN2_N, RXIN2_P, RXIN3_N, RXIN3_P, TXOUT1_N, TXOUT1_P, TXOUT2_N, TXOUT2_P

### Nets
RXIN1_N: sheet RF_Transceiver_LMS6003D_TopLevel/LMS6002_RF_TR.RXIN1_N, sheet RF_Receive/LMS6002_RF_TR.RXIN1_N, sheet RF_Transmit/LMS6002_RF_TR.RXIN1_N
RXIN1_P: sheet RF_Transceiver_LMS6003D_TopLevel/LMS6002_RF_TR.RXIN1_P, sheet RF_Receive/LMS6002_RF_TR.RXIN1_P, sheet RF_Transmit/LMS6002_RF_TR.RXIN1_P
RXIN2_N: sheet RF_Transceiver_LMS6003D_TopLevel/LMS6002_RF_TR.RXIN2_N, sheet RF_Receive/LMS6002_RF_TR.RXIN2_N, sheet RF_Transmit/LMS6002_RF_TR.RXIN2_N
RXIN2_P: sheet RF_Transceiver_LMS6003D_TopLevel/LMS6002_RF_TR.RXIN2_P, sheet RF_Receive/LMS6002_RF_TR.RXIN2_P, sheet RF_Transmit/LMS6002_RF_TR.RXIN2_P
RXIN3_N: sheet RF_Transceiver_LMS6003D_TopLevel/LMS6002_RF_TR.RXIN3_N, sheet RF_Receive/LMS6002_RF_TR.RXIN3_N, sheet RF_Transmit/LMS6002_RF_TR.RXIN3_N
RXIN3_P: sheet RF_Transceiver_LMS6003D_TopLevel/LMS6002_RF_TR.RXIN3_P, sheet RF_Receive/LMS6002_RF_TR.RXIN3_P, sheet RF_Transmit/LMS6002_RF_TR.RXIN3_P
TXOUT1_N: sheet RF_Transceiver_LMS6003D_TopLevel/LMS6002_RF_TR.TXOUT1_N, sheet RF_Receive/LMS6002_RF_TR.TXOUT1_N, sheet RF_Transmit/LMS6002_RF_TR.TXOUT1_N
TXOUT1_P: sheet RF_Transceiver_LMS6003D_TopLevel/LMS6002_RF_TR.TXOUT1_P, sheet RF_Receive/LMS6002_RF_TR.TXOUT1_P, sheet RF_Transmit/LMS6002_RF_TR.TXOUT1_P
TXOUT2_N: sheet RF_Transceiver_LMS6003D_TopLevel/LMS6002_RF_TR.TXOUT2_N, sheet RF_Receive/LMS6002_RF_TR.TXOUT2_N, sheet RF_Transmit/LMS6002_RF_TR.TXOUT2_N
TXOUT2_P: sheet RF_Transceiver_LMS6003D_TopLevel/LMS6002_RF_TR.TXOUT2_P, sheet RF_Receive/LMS6002_RF_TR.TXOUT2_P, sheet RF_Transmit/LMS6002_RF_TR.TXOUT2_P

### Buses and harness runs
harness port LM_SPI = sheet RF_Transceiver_LMS6003D_TopLevel/LM_SPI
harness port ZYNQ_LMS_DIG_IO = sheet RF_Transceiver_LMS6003D_TopLevel/ZYNQ_LMS_DIG_IO

## Sheet RF_Receive.SchDoc
size A4; DocumentNumber: 27; SheetNumber: 27; SheetTotal: 47
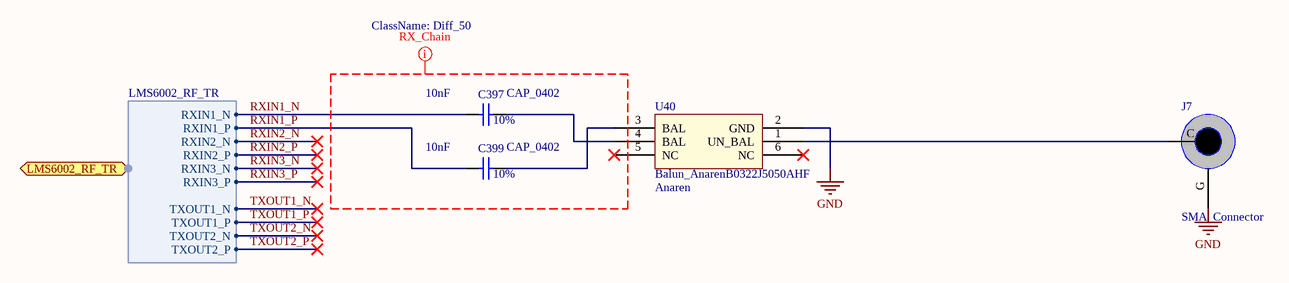
[diagram p24: RF_Receive.SchDoc]

### Parts
C397  CAP_0402  value 10nF  Tolerance: 10%  [CAPC0402(1005)60_N]
C399  CAP_0402  value 10nF  Tolerance: 10%  [CAPC0402(1005)60_N]
J7  SMA_Connector  [Connector_SMA_Amphenol_132255_Edgemount]
U40  Balun_AnarenB0322J5050AHF  Manufacturer: Anaren  [Balun_AnarenB0322J5050AHF_6-PIN_SMD]

### Ports
LMS6002_RF_TR (harness LMS6002_RF_TR)

### Harnesses
LMS6002_RF_TR: RXIN1_N, RXIN1_P, RXIN2_N, RXIN2_P, RXIN3_N, RXIN3_P, TXOUT1_N, TXOUT1_P, TXOUT2_N, TXOUT2_P

### Nets
GND: J7.G U40.2(GND)
RXIN1_N: C397.1 ; port LMS6002_RF_TR.RXIN1_N
RXIN1_P: C399.1 ; port LMS6002_RF_TR.RXIN1_P
NetC397_2: C397.2 U40.4(BAL)
NetC399_2: C399.2 U40.3(BAL)
NetJ7_C: J7.C U40.1(UN_BAL)

Not connected (* = marked no-connect by the designer): U40 5(NC)* 6(NC)*

### Layout directives
net class Diff_50: (no net found under the mark)

### Library data of the parts
C397 C399 = ATC520L-103KT16T: CAP 10nF, 16V, 10%, EIA 0402; Manufacturer: ATC; Part Number: ATC520L-103KT16T; Footprint Ref: CAPC0402(1005)60_N; Library Ref: CAP_0402
J7 = 132255: CONN RCPT SMA END LAUNCH PCB; Part Number: 132255; Manufacturer: Amphenol Connex
U40 = B0322J5050AHF: Ultra Low Profile 0805 Balun, 50 ohm unbalanced to 50  Balanced; Part Number: B0322J5050AHF; Footprint Ref: Balun_AnarenB0322J5050AHF_6-PIN_SMD; Library Ref: Balun_AnarenB0322J5050AHF

## Sheet RF_Transmit.SchDoc
size A4; DocumentNumber: 28; SheetNumber: 28; SheetTotal: 47
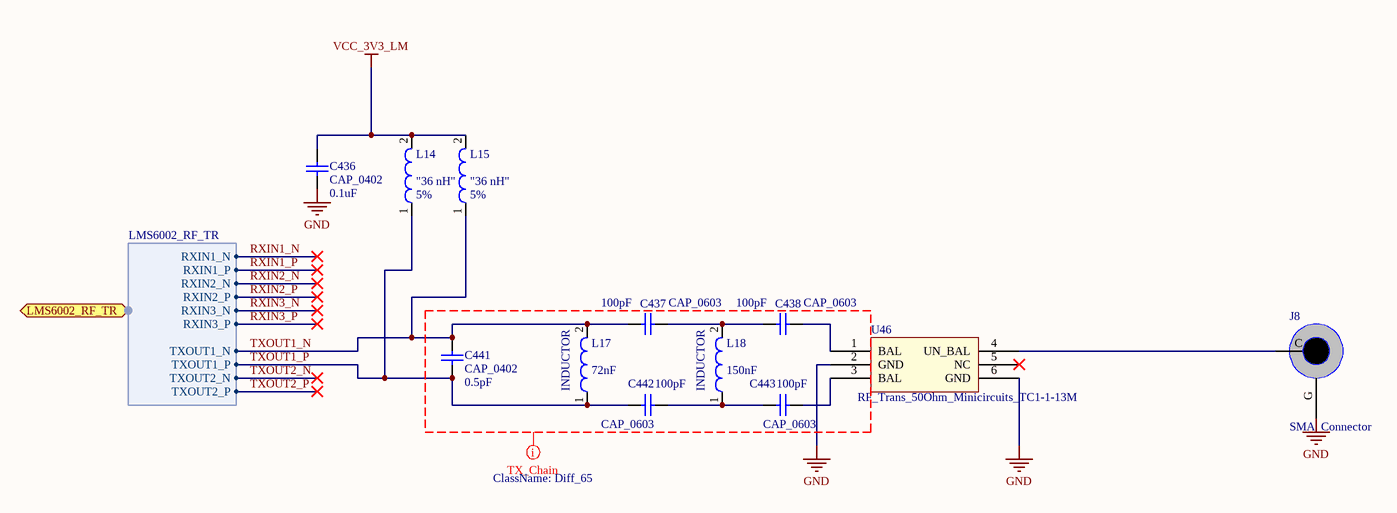
[diagram p25: RF_Transmit.SchDoc]

### Parts
C436  CAP_0402  value 0.1uF  [CAPC0402(1005)60_N]
C437  CAP_0603  value 100pF  [CAPC0603(1608)100_N]
C438  CAP_0603  value 100pF  [CAPC0603(1608)100_N]
C441  CAP_0402  value 0.5pF  [CAPC0402(1005)60_N]
C442  CAP_0603  value 100pF  [CAPC0603(1608)100_N]
C443  CAP_0603  value 100pF  [CAPC0603(1608)100_N]
J8  SMA_Connector  [Connector_SMA_Amphenol_132255_Edgemount]
L14  value "36 nH"  Tolerance: 5%  [Inductor0402(1005)]  (hidden comment: INDUCTOR)
L15  value "36 nH"  Tolerance: 5%  [Inductor0402(1005)]  (hidden comment: INDUCTOR)
L17  INDUCTOR  value 72nF  [Inductor0603(1608)]
L18  INDUCTOR  value 150nF  [Inductor0603(1608)]
U46  RF_Trans_50Ohm_Minicircuits_TC1-1-13M  [RF_Trans_50Ohm_Minicircuits_TC1-1-13M_AT224]

### Ports
LMS6002_RF_TR (harness LMS6002_RF_TR)

### Harnesses
LMS6002_RF_TR: RXIN1_N, RXIN1_P, RXIN2_N, RXIN2_P, RXIN3_N, RXIN3_P, TXOUT1_N, TXOUT1_P, TXOUT2_N, TXOUT2_P

### Nets
GND: C436.1 J8.G U46.2(GND) U46.6(GND)
VCC_3V3_LM: C436.2 L14.2 L15.2
TXOUT1_N: C437.1 C441.2 L15.1 L17.2 ; port LMS6002_RF_TR.TXOUT1_N
TXOUT1_P: C441.1 C442.1 L14.1 L17.1 ; port LMS6002_RF_TR.TXOUT1_P
NetC437_2: C437.2 C438.1 L18.2
NetC438_2: C438.2 U46.1(BAL)
NetC442_2: C442.2 C443.1 L18.1
NetC443_2: C443.2 U46.3(BAL)
NetJ8_C: J8.C U46.4(UN_BAL)

Not connected (* = marked no-connect by the designer): U46 5(NC)*

### Layout directives
net class Diff_65: (no net found under the mark)

### Library data of the parts
C436 = C1005X5R0J104K: 0.1uf, ceramic, 10%, 6.3V, X5R, 0402; Manufacturer: TDK Corporation; Tolerance: 10%; Part Number: C1005X5R0J104K
C437 C438 C442 C443 = VJ0603D101JXCAJ: CAP CER 100PF 200V 5% NP0 0603; Manufacturer: Vishay Vitramon; Tolerance: 5%; Part Number: VJ0603D101JXCAJ
C441 = C0402C508D3GACTU: CAP CER 0.5PF 25V NP0 0402; Manufacturer: Kemet; Part Number: C0402C508D3GACTU
J8 = 132255: as J7 on sheet RF_Receive
L14 L15 = "0402CS-36NX_L": Inductor 36 nH 0402 5%; Manufacturer: Coilcraft; Part Number: "0402CS-36NX_L"; Library Ref: INDUCTOR; Footprint Ref: Inductor0402(1005)
L17 = 0603LS-72NXGLB: INDUCTOR, 72nF, 2%, 1.4A, 0603; Manufacturer: Coilcraft; Tolerance: 2%; Part Number: 0603LS-72NXGLB
L18 = 0603LS-151XGLB: INDUCTOR, 150nF, 2%, 1.4A, 0603; Manufacturer: Coilcraft; Tolerance: 2%; Part Number: 0603LS-151XGLB
U46 = TC1-1-13M: RF Transformer, 50 Ohm, 4.5 to 3000 MHz, Leadless Surface Mount, AT224; Part Number: TC1-1-13M; Manufacturer: Minicircuits

## Sheet RF_Transceiver_LMS6003D_TopLevel.SchDoc
size A4; DocumentNumber: 44; SheetNumber: 44; SheetTotal: 47
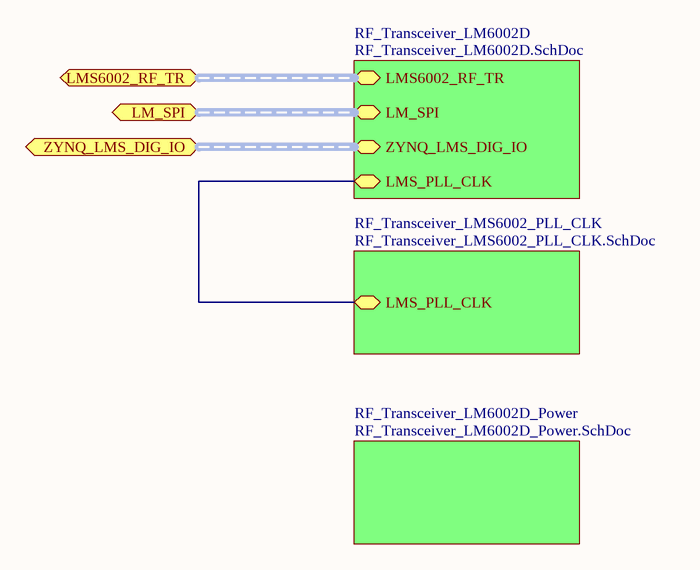
[diagram p26: RF_Transceiver_LMS6003D_TopLevel.SchDoc]

### Sub-sheets
RF_Transceiver_LM6002D = RF_Transceiver_LM6002D.SchDoc: LMS6002_RF_TR (harness LMS6002_RF_TR), LM_SPI (harness LM_SPI), ZYNQ_LMS_DIG_IO (harness DIG_IO), LMS_PLL_CLK (bidir)
RF_Transceiver_LM6002D_Power = RF_Transceiver_LM6002D_Power.SchDoc: no entries
RF_Transceiver_LMS6002_PLL_CLK = RF_Transceiver_LMS6002_PLL_CLK.SchDoc: LMS_PLL_CLK (bidir)

### Ports
LM_SPI (harness LM_SPI), LMS6002_RF_TR (harness LMS6002_RF_TR), ZYNQ_LMS_DIG_IO (harness DIG_IO)

### Nets
PLL_CLK: sheet RF_Transceiver_LM6002D/LMS_PLL_CLK, sheet RF_Transceiver_LMS6002_PLL_CLK/LMS_PLL_CLK

### Buses and harness runs
harness port LM_SPI = sheet RF_Transceiver_LM6002D/LM_SPI
harness port LMS6002_RF_TR = sheet RF_Transceiver_LM6002D/LMS6002_RF_TR
harness port ZYNQ_LMS_DIG_IO = sheet RF_Transceiver_LM6002D/ZYNQ_LMS_DIG_IO

## Sheet RF_Transceiver_LM6002D.SchDoc
size A4; DocumentNumber: 24; SheetNumber: 24; SheetTotal: 47
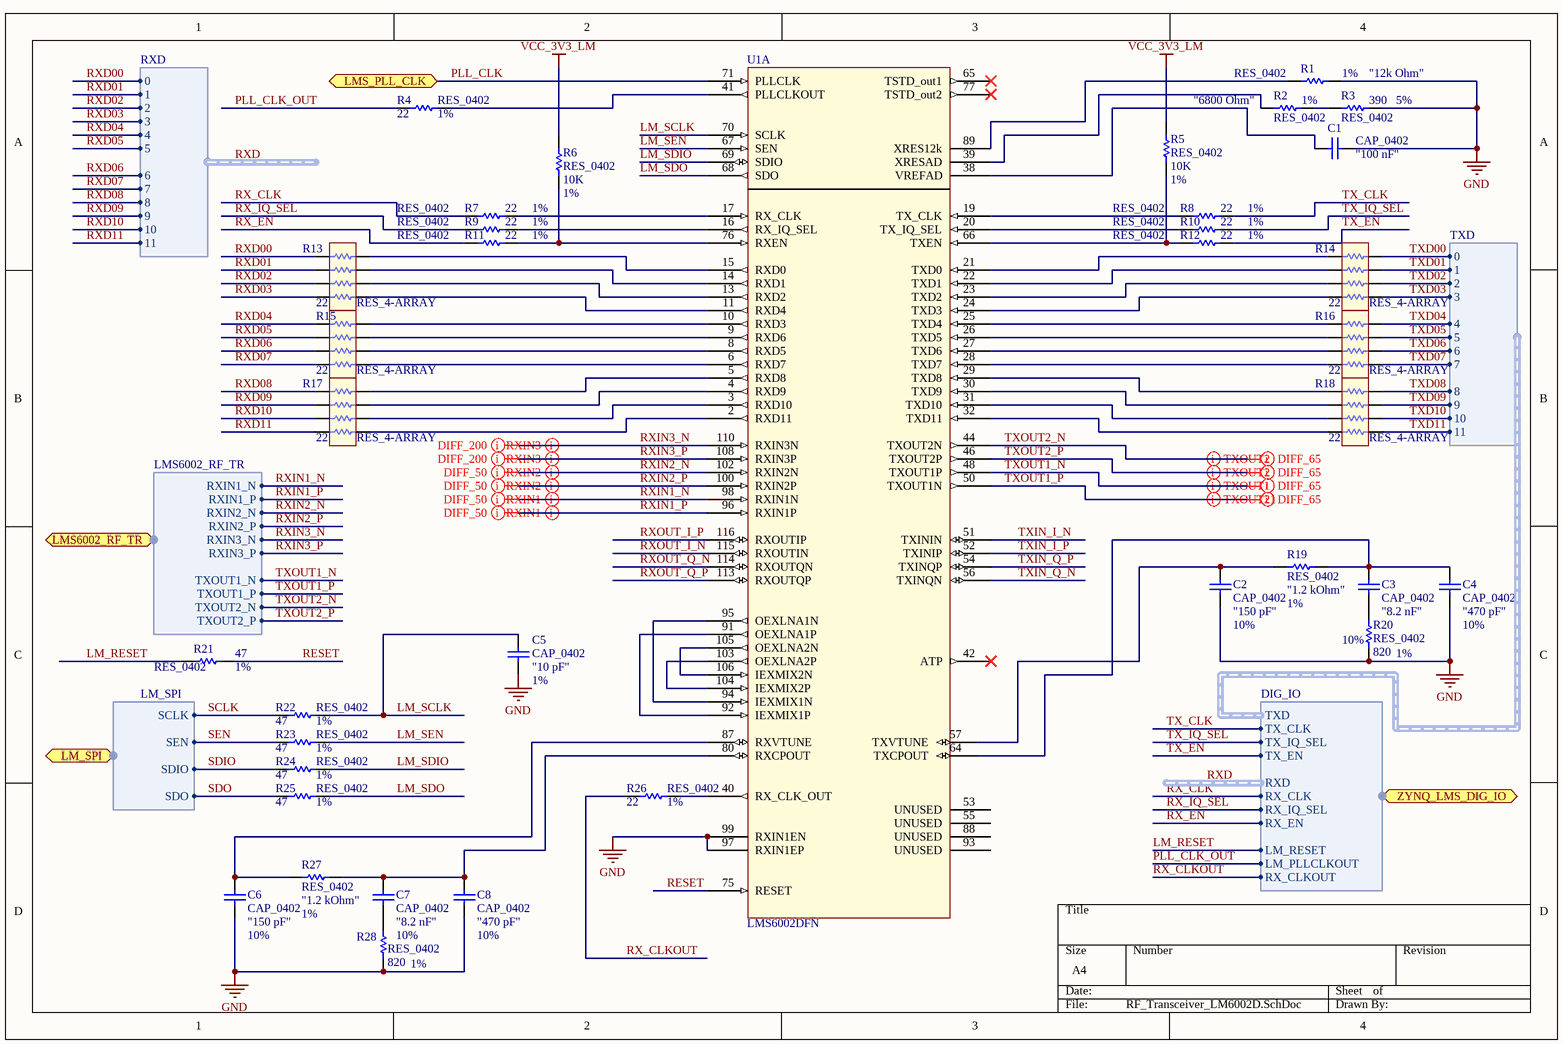
[diagram p27: RF_Transceiver_LM6002D.SchDoc]

### Parts
C1  CAP_0402  value "100 nF"  [CAPC0402(1005)60_N]
C2  CAP_0402  value "150 pF"  Tolerance: 10%  [CAPC0402(1005)60_N]
C3  CAP_0402  value "8.2 nF"  Tolerance: 10%  [CAPC0402(1005)60_N]
C4  CAP_0402  value "470 pF"  Tolerance: 10%  [CAPC0402(1005)60_N]
C5  CAP_0402  value "10 pF"  Tolerance: 1%  [CAPC0402(1005)60_N]
C6  CAP_0402  value "150 pF"  Tolerance: 10%  [CAPC0402(1005)60_N]
C7  CAP_0402  value "8.2 nF"  Tolerance: 10%  [CAPC0402(1005)60_N]
C8  CAP_0402  value "470 pF"  Tolerance: 10%  [CAPC0402(1005)60_N]
R1  RES_0402  value "12k Ohm"  Tolerance: 1%  [RESC0402(1005)_N]
R2  RES_0402  value "6800 Ohm"  Tolerance: 1%  [RESC0402(1005)_N]
R3  RES_0402  value 390  Tolerance: 5%  [RESC0402(1005)_N]
R4  RES_0402  value 22  Tolerance: 1%  [RESC0402(1005)_N]
R5  RES_0402  value 10K  Tolerance: 1%  [RESC0402(1005)_N]
R6  RES_0402  value 10K  Tolerance: 1%  [RESC0402(1005)_N]
R7  RES_0402  value 22  Tolerance: 1%  [RESC0402(1005)_N]
R8  RES_0402  value 22  Tolerance: 1%  [RESC0402(1005)_N]
R9  RES_0402  value 22  Tolerance: 1%  [RESC0402(1005)_N]
R10  RES_0402  value 22  Tolerance: 1%  [RESC0402(1005)_N]
R11  RES_0402  value 22  Tolerance: 1%  [RESC0402(1005)_N]
R12  RES_0402  value 22  Tolerance: 1%  [RESC0402(1005)_N]
R13  RES_4-ARRAY  value 22  [RES_4-ARRAY_YC124-JR-0722RL]
R14  RES_4-ARRAY  value 22  [RES_4-ARRAY_YC124-JR-0722RL]
R15  RES_4-ARRAY  value 22  [RES_4-ARRAY_YC124-JR-0722RL]
R16  RES_4-ARRAY  value 22  [RES_4-ARRAY_YC124-JR-0722RL]
R17  RES_4-ARRAY  value 22  [RES_4-ARRAY_YC124-JR-0722RL]
R18  RES_4-ARRAY  value 22  [RES_4-ARRAY_YC124-JR-0722RL]
R19  RES_0402  value "1.2 kOhm"  Tolerance: 1%  [RESC0402(1005)_N]
R20  RES_0402  value 820  Tolerance: 1%  [RESC0402(1005)_N]
R21  RES_0402  value 47  Tolerance: 1%  [RESC0402(1005)_N]
R22  RES_0402  value 47  Tolerance: 1%  [RESC0402(1005)_N]
R23  RES_0402  value 47  Tolerance: 1%  [RESC0402(1005)_N]
R24  RES_0402  value 47  Tolerance: 1%  [RESC0402(1005)_N]
R25  RES_0402  value 47  Tolerance: 1%  [RESC0402(1005)_N]
R26  RES_0402  value 22  Tolerance: 1%  [RESC0402(1005)_N]
R27  RES_0402  value "1.2 kOhm"  Tolerance: 1%  [RESC0402(1005)_N]
R28  RES_0402  value 820  Tolerance: 1%  [RESC0402(1005)_N]
U1  LMS6002DFN  [RF_Transceiver_LimeMicro_LMS6002D_DQFN-116]  (part A of 2)

### Ports
LM_SPI (harness LM_SPI), LMS6002_RF_TR (harness LMS6002_RF_TR), LMS_PLL_CLK (bidir), ZYNQ_LMS_DIG_IO (harness DIG_IO)

### Harnesses
LMS6002_RF_TR: RXIN1_N, RXIN1_P, RXIN2_N, RXIN2_P, RXIN3_N, RXIN3_P, TXOUT1_N, TXOUT1_P, TXOUT2_N, TXOUT2_P
LM_SPI: SCLK, SEN, SDIO, SDO
TXD: 0, 1, 2, 3, 4, 5, 6, 7, 8, 9, 10, 11
DIG_IO: TXD, TX_CLK, TX_IQ_SEL, TX_EN, RXD, RX_CLK, RX_IQ_SEL, RX_EN, LM_RESET, LM_PLLCLKOUT, RX_CLKOUT
RXD: 0, 1, 2, 3, 4, 5, 6, 7, 8, 9, 10, 11

### Nets
GND: C1.2 C2.1 C4.1 C5.1 C6.1 C8.1 R1.2 R3.2 R20.1 R28.1 U1.97(RXIN1EP) U1.99(RXIN1EN)
VCC_3V3_LM: R5.2 R6.2
LM_RESET: R21.1 ; port ZYNQ_LMS_DIG_IO.LM_RESET
LM_SCLK: C5.2 R22.2 U1.70(SCLK)
LM_SDIO: R24.2 U1.69(SDIO)
LM_SDO: R25.2 U1.68(SDO)
LM_SEN: R23.2 U1.67(SEN)
PLL_CLK: U1.71(PLLCLK) ; port LMS_PLL_CLK
PLL_CLK_OUT: R4.1 ; port ZYNQ_LMS_DIG_IO.LM_PLLCLKOUT
RESET: R21.2 U1.75(RESET)
RX_CLK: R7.1 ; port ZYNQ_LMS_DIG_IO.RX_CLK
RX_CLKOUT: R26.1 ; port ZYNQ_LMS_DIG_IO.RX_CLKOUT
RX_EN: R11.1 ; port ZYNQ_LMS_DIG_IO.RX_EN
RX_IQ_SEL: R9.1 ; port ZYNQ_LMS_DIG_IO.RX_IQ_SEL
RXD00: R13.8 ; harness RXD.0  [project net RXD.0]
RXD01: R13.7 ; harness RXD.1  [project net RXD.1]
RXD02: R13.6 ; harness RXD.2  [project net RXD.2]
RXD03: R13.5 ; harness RXD.3  [project net RXD.3]
RXD04: R15.8 ; harness RXD.4  [project net RXD.4]
RXD05: R15.7 ; harness RXD.5  [project net RXD.5]
RXD06: R15.6 ; harness RXD.6  [project net RXD.6]
RXD07: R15.5 ; harness RXD.7  [project net RXD.7]
RXD08: R17.8 ; harness RXD.8  [project net RXD.8]
RXD09: R17.7 ; harness RXD.9  [project net RXD.9]
RXD10: R17.6 ; harness RXD.10  [project net RXD.10]
RXD11: R17.5 ; harness RXD.11  [project net RXD.11]
RXIN1_N: U1.98(RXIN1N) ; port LMS6002_RF_TR.RXIN1_N
RXIN1_P: U1.96(RXIN1P) ; port LMS6002_RF_TR.RXIN1_P
RXIN2_N: U1.102(RXIN2N) ; port LMS6002_RF_TR.RXIN2_N
RXIN2_P: U1.100(RXIN2P) ; port LMS6002_RF_TR.RXIN2_P
RXIN3_N: U1.110(RXIN3N) ; port LMS6002_RF_TR.RXIN3_N
RXIN3_P: U1.108(RXIN3P) ; port LMS6002_RF_TR.RXIN3_P
RXOUT_I_N: U1.115(RXOUTIN)
RXOUT_I_P: U1.116(RXOUTIP)
RXOUT_Q_N: U1.114(RXOUTQN)
RXOUT_Q_P: U1.113(RXOUTQP)
SCLK: R22.1 ; port LM_SPI.SCLK
SDIO: R24.1 ; port LM_SPI.SDIO
SDO: R25.1 ; port LM_SPI.SDO
SEN: R23.1 ; port LM_SPI.SEN
TX_CLK: R8.2 ; port ZYNQ_LMS_DIG_IO.TX_CLK
TX_EN: R12.2 ; port ZYNQ_LMS_DIG_IO.TX_EN
TX_IQ_SEL: R10.2 ; port ZYNQ_LMS_DIG_IO.TX_IQ_SEL
TXD00: R14.1 ; harness TXD.0
TXD01: R14.2 ; harness TXD.1
TXD02: R14.3 ; harness TXD.2
TXD03: R14.4 ; harness TXD.3
TXD04: R16.1 ; harness TXD.4
TXD05: R16.2 ; harness TXD.5
TXD06: R16.3 ; harness TXD.6
TXD07: R16.4 ; harness TXD.7
TXD08: R18.1 ; harness TXD.8
TXD09: R18.2 ; harness TXD.9
TXD10: R18.3 ; harness TXD.10
TXD11: R18.4 ; harness TXD.11
TXIN_I_N: U1.51(TXININ)
TXIN_I_P: U1.52(TXINIP)
TXIN_Q_N: U1.56(TXINQN)
TXIN_Q_P: U1.54(TXINQP)
TXOUT1_N: U1.48(TXOUT1P) ; port LMS6002_RF_TR.TXOUT1_N
TXOUT1_P: U1.50(TXOUT1N) ; port LMS6002_RF_TR.TXOUT1_P
TXOUT2_N: U1.44(TXOUT2N) ; port LMS6002_RF_TR.TXOUT2_N
TXOUT2_P: U1.46(TXOUT2P) ; port LMS6002_RF_TR.TXOUT2_P
NetC1_1: C1.1 U1.38(VREFAD)
NetC2_2: C2.2 R19.1 U1.57(TXVTUNE)
NetC3_1: C3.1 R20.2
NetC3_2: C3.2 C4.2 R19.2 U1.64(TXCPOUT)
NetC6_2: C6.2 R27.1 U1.87(RXVTUNE)
NetC7_1: C7.1 R28.2
NetC7_2: C7.2 C8.2 R27.2 U1.80(RXCPOUT)
NetR1_1: R1.1 U1.89(XRES12k)
NetR2_1: R2.1 U1.39(XRESAD)
NetR2_2: R2.2 R3.1
NetR4_2: R4.2 U1.41(PLLCLKOUT)
NetR5_1: R5.1 R12.1 U1.66(TXEN)
NetR6_1: R6.1 R11.2 U1.76(RXEN)
NetR7_2: R7.2 U1.17(RX_CLK)
NetR8_1: R8.1 U1.19(TX_CLK)
NetR9_2: R9.2 U1.16(RX_IQ_SEL)
NetR10_1: R10.1 U1.20(TX_IQ_SEL)
NetR13_1: R13.1 U1.15(RXD0)
NetR13_2: R13.2 U1.14(RXD1)
NetR13_3: R13.3 U1.13(RXD2)
NetR13_4: R13.4 U1.11(RXD4)
NetR14_5: R14.5 U1.24(TXD3)
NetR14_6: R14.6 U1.23(TXD2)
NetR14_7: R14.7 U1.22(TXD1)
NetR14_8: R14.8 U1.21(TXD0)
NetR15_1: R15.1 U1.10(RXD3)
NetR15_2: R15.2 U1.9(RXD6)
NetR15_3: R15.3 U1.8(RXD5)
NetR15_4: R15.4 U1.6(RXD7)
NetR16_5: R16.5 U1.28(TXD7)
NetR16_6: R16.6 U1.27(TXD6)
NetR16_7: R16.7 U1.26(TXD5)
NetR16_8: R16.8 U1.25(TXD4)
NetR17_1: R17.1 U1.5(RXD8)
NetR17_2: R17.2 U1.4(RXD9)
NetR17_3: R17.3 U1.3(RXD10)
NetR17_4: R17.4 U1.2(RXD11)
NetR18_5: R18.5 U1.32(TXD11)
NetR18_6: R18.6 U1.31(TXD10)
NetR18_7: R18.7 U1.30(TXD9)
NetR18_8: R18.8 U1.29(TXD8)
NetR26_2: R26.2 U1.40(RX_CLK_OUT)
NetU1_91: U1.91(OEXLNA1P) U1.92(IEXMIX1P)
NetU1_94: U1.94(IEXMIX1N) U1.95(OEXLNA1N)
NetU1_103: U1.103(OEXLNA2P) U1.104(IEXMIX2P)
NetU1_105: U1.105(OEXLNA2N) U1.106(IEXMIX2N)

Not connected (* = marked no-connect by the designer): U1 42(ATP)* 53(UNUSED) 55(UNUSED) 65(TSTD_out1)* 77(TSTD_out2)* 88(UNUSED) 93(UNUSED)

### Layout directives
differential pair: RXIN1_N, RXIN1_P, RXIN2_N, RXIN2_P, RXIN3_N, RXIN3_P, TXOUT1_N, TXOUT1_P, TXOUT2_N, TXOUT2_P
mark named DIFF_65: TXOUT1_N, TXOUT1_P, TXOUT2_N, TXOUT2_P
mark named DIFF_200: RXIN3_N, RXIN3_P
mark named DIFF_50: RXIN1_N, RXIN1_P, RXIN2_N, RXIN2_P

### Library data of the parts
C1 = "C0402C104K8PAC": C 100 nF 16 V 0402 X5R; Manufacturer: KEMET; Tolerance: *; Part Number: "C0402C104K8PAC"; Footprint Ref: CAPC0402(1005)60_N; Library Ref: CAP_0402
C2 C6 = "MCCA000122": C 470pF 50V X7R 10% 0402; Manufacturer: MULTICOMP; Part Number: "MCCA000122"; Footprint Ref: CAPC0402(1005)60_N; Library Ref: CAP_0402
C3 C7 = "MCCA000039": C 470pF 50V X7R 10% 0402; Manufacturer: MULTICOMP; Part Number: "MCCA000039"; Footprint Ref: CAPC0402(1005)60_N; Library Ref: CAP_0402
C4 C8 = "MCCA000132": C 470pF 50V X7R 10% 0402; Manufacturer: MULTICOMP; Part Number: "MCCA000132"; Footprint Ref: CAPC0402(1005)60_N; Library Ref: CAP_0402
C5 = "MC0402N100F500CT": C 10pF 1% 50V NP0 0402; Manufacturer: MULTICOMP; Part Number: "MC0402N100F500CT"; Footprint Ref: CAPC0402(1005)60_N; Library Ref: CAP_0402
R1 = "MC 0.0625W 0402 1% 12K": R 12 kOhm 1 % 63 mW 0402; Manufacturer: MULTICOMP; Part Number: "MC 0.0625W 0402 1% 12K"; Footprint Ref: RESC0402(1005)_N; Library Ref: RES_0402
R2 = "232270676802": R 6800 Ohm 1 % 63 mW 0402; Manufacturer: PHYCOMP; Part Number: "232270676802"; Footprint Ref: RESC0402(1005)_N; Library Ref: RES_0402
R3 = RC0402JR-07390RL: 390 ohm, 5%, 1/16W, 0402; Manufacturer: Yageo America; Part Number: RC0402JR-07390RL; Footprint Ref: RESC0402(1005)_N; Library Ref: RES_0402
R4 R7-R12 R26 = ERJ-2RKF22R0X: RES 22.0 OHM 1/10W 1% 0402 SMD; Manufacturer: Panasonic Electronic Components; Part Number: ERJ-2RKF22R0X
R5 R6 = ERJ-2RKF1002X: RES 10.0K OHM 1/10W 1% 0402 SMD; Manufacturer: Panasonic Electronic Components; Part Number: ERJ-2RKF1002X
R13-R18 = YC124-JR-0722RL: RES ARRAY 22 OHM 4 RES 0804; Manufacturer: Yageo; Tolerance: *; Part Number: YC124-JR-0722RL
R19 R27 = "CRCW04021K20FKEAHP": R 1k2 Ohm 1% 63mV 0402; Manufacturer: VISHAY DRALORIC; Part Number: "CRCW04021K20FKEAHP"; Footprint Ref: RESC0402(1005)_N; Library Ref: RES_0402
R20 R28 = ERJ-2RKF8200X: RES 820 OHM 1/10W 1% 0402 SMD; Manufacturer: Panasonic Electronic Components; Part Number: ERJ-2RKF8200X; Footprint Ref: RESC0402(1005)_N; Library Ref: RES_0402
R21-R25 = ERJ-2RKF47R0X: RES 47.0 OHM 1/10W 1% 0402 SMD; Manufacturer: Panasonic Electronic Components; Part Number: ERJ-2RKF47R0X
U1 = LMS6002DFN: RF Transceiver LMS6002D, 120 pin DQFN package, 1.8V and 3.3V; Manufacturer: Lime Micro; Part Number: LMS6002DFN

## Sheet RF_Transceiver_LM6002D_Power.SchDoc
size A4; DocumentNumber: 26; SheetNumber: 26; SheetTotal: 47
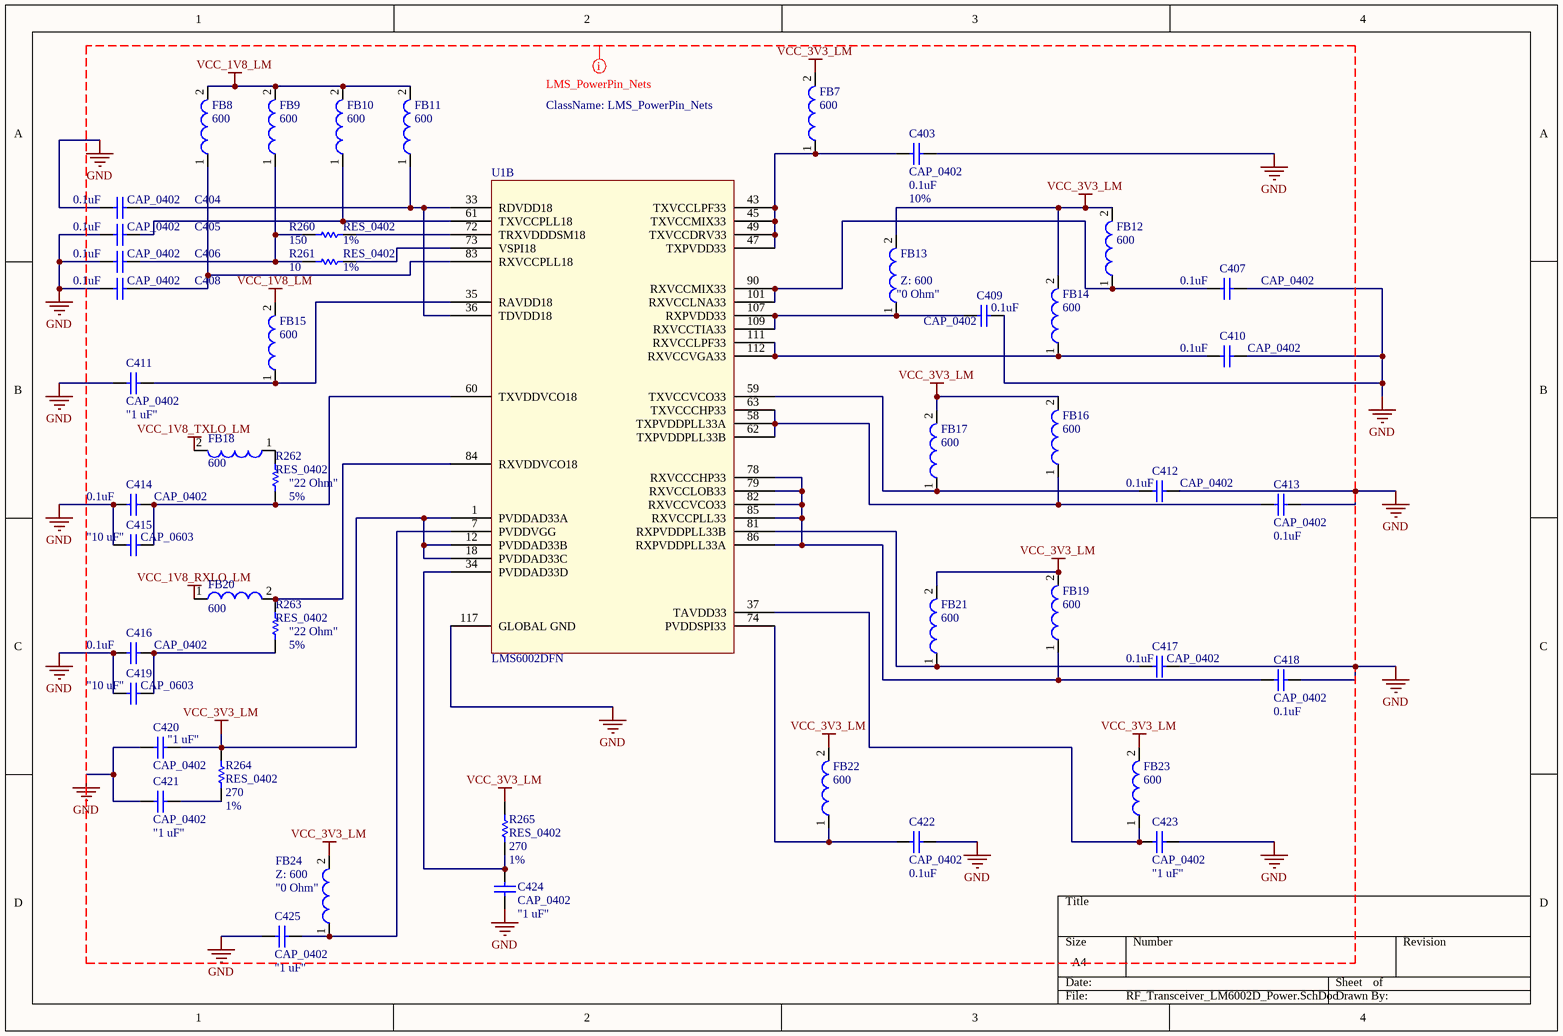
[diagram p28: RF_Transceiver_LM6002D_Power.SchDoc]

### Parts
C403  CAP_0402  value 0.1uF  Tolerance: 10%  [CAPC0402(1005)60_N]
C404  CAP_0402  value 0.1uF  [CAPC0402(1005)60_N]
C405  CAP_0402  value 0.1uF  [CAPC0402(1005)60_N]
C406  CAP_0402  value 0.1uF  [CAPC0402(1005)60_N]
C407  CAP_0402  value 0.1uF  [CAPC0402(1005)60_N]
C408  CAP_0402  value 0.1uF  [CAPC0402(1005)60_N]
C409  CAP_0402  value 0.1uF  [CAPC0402(1005)60_N]
C410  CAP_0402  value 0.1uF  [CAPC0402(1005)60_N]
C411  CAP_0402  value "1 uF"  [CAPC0402(1005)60_N]
C412  CAP_0402  value 0.1uF  [CAPC0402(1005)60_N]
C413  CAP_0402  value 0.1uF  [CAPC0402(1005)60_N]
C414  CAP_0402  value 0.1uF  [CAPC0402(1005)60_N]
C415  CAP_0603  value "10 uF"  [CAPC0603(1608)100_N]
C416  CAP_0402  value 0.1uF  [CAPC0402(1005)60_N]
C417  CAP_0402  value 0.1uF  [CAPC0402(1005)60_N]
C418  CAP_0402  value 0.1uF  [CAPC0402(1005)60_N]
C419  CAP_0603  value "10 uF"  [CAPC0603(1608)100_N]
C420  CAP_0402  value "1 uF"  [CAPC0402(1005)60_N]
C421  CAP_0402  value "1 uF"  [CAPC0402(1005)60_N]
C422  CAP_0402  value 0.1uF  [CAPC0402(1005)60_N]
C423  CAP_0402  value "1 uF"  [CAPC0402(1005)60_N]
C424  CAP_0402  value "1 uF"  [CAPC0402(1005)60_N]
C425  CAP_0402  value "1 uF"  [CAPC0402(1005)60_N]
FB7  Z: 600  [Inductor0402(1005)]  (hidden comment: FerriteBead)
FB8  Z: 600  [Inductor0402(1005)]  (hidden comment: FerriteBead)
FB9  Z: 600  [Inductor0402(1005)]  (hidden comment: FerriteBead)
FB10  Z: 600  [Inductor0402(1005)]  (hidden comment: FerriteBead)
FB11  Z: 600  [Inductor0402(1005)]  (hidden comment: FerriteBead)
FB12  Z: 600  [Inductor0402(1005)]  (hidden comment: FerriteBead)
FB13  value "0 Ohm"  Z: 600  [Inductor0402(1005)]  (hidden comment: FerriteBead)
FB14  Z: 600  [Inductor0402(1005)]  (hidden comment: FerriteBead)
FB15  Z: 600  [Inductor0402(1005)]  (hidden comment: FerriteBead)
FB16  Z: 600  [Inductor0402(1005)]  (hidden comment: FerriteBead)
FB17  Z: 600  [Inductor0402(1005)]  (hidden comment: FerriteBead)
FB18  Z: 600  [Inductor0402(1005)]  (hidden comment: FerriteBead)
FB19  Z: 600  [Inductor0402(1005)]  (hidden comment: FerriteBead)
FB20  Z: 600  [Inductor0402(1005)]  (hidden comment: FerriteBead)
FB21  Z: 600  [Inductor0402(1005)]  (hidden comment: FerriteBead)
FB22  Z: 600  [Inductor0402(1005)]  (hidden comment: FerriteBead)
FB23  Z: 600  [Inductor0402(1005)]  (hidden comment: FerriteBead)
FB24  value "0 Ohm"  Z: 600  [Inductor0402(1005)]  (hidden comment: FerriteBead)
R260  RES_0402  value 150  Tolerance: 1%  [RESC0402(1005)_N]
R261  RES_0402  value 10  Tolerance: 1%  [RESC0402(1005)_N]
R262  RES_0402  value "22 Ohm"  Tolerance: 5%  [RESC0402(1005)_N]
R263  RES_0402  value "22 Ohm"  Tolerance: 5%  [RESC0402(1005)_N]
R264  RES_0402  value 270  Tolerance: 1%  [RESC0402(1005)_N]
R265  RES_0402  value 270  Tolerance: 1%  [RESC0402(1005)_N]
U1  LMS6002DFN  [RF_Transceiver_LimeMicro_LMS6002D_DQFN-116]  (part B of 2)

### Nets
GND: C403.1 C404.2 C405.2 C406.2 C407.1 C408.2 C409.1 C410.1 C411.1 C412.1 C413.1 C414.2 C415.1 C416.2 C417.1 C418.1 C419.1 C420.1 C421.1 C422.1 C423.2 C424.1 C425.1 U1.117(GLOBAL_GND)
VCC_1V8_LM: FB8.2 FB9.2 FB10.2 FB11.2 FB15.2
VCC_1V8_RXLO_LM: FB20.1
VCC_1V8_TXLO_LM: FB18.2
VCC_3V3_LM: C420.2 FB7.2 FB12.2 FB13.2 FB14.2 FB16.2 FB17.2 FB19.2 FB21.2 FB22.2 FB23.2 FB24.2 R264.2 R265.1 U1.1(PVDDAD33A) U1.12(PVDDAD33B) U1.18(PVDDAD33C)
NetC403_2: C403.2 FB7.1 U1.43(TXVCCLPF33) U1.45(TXVCCMIX33) U1.47(TXPVDD33) U1.49(TXVCCDRV33)
NetC404_1: C404.1 FB11.1 U1.33(RDVDD18) U1.36(TDVDD18)
NetC405_1: C405.1 FB10.1 U1.61(TXVCCPLL18)
NetC406_1: C406.1 FB9.1 R260.1 R261.1
NetC407_2: C407.2 FB12.1 U1.90(RXVCCMIX33) U1.101(RXVCCLNA33)
NetC408_1: C408.1 FB8.1 U1.83(RXVCCPLL18)
NetC409_2: C409.2 FB13.1 U1.107(RXPVDD33) U1.109(RXVCCTIA33)
NetC410_2: C410.2 FB14.1 U1.111(RXVCCLPF33) U1.112(RXVCCVGA33)
NetC411_2: C411.2 FB15.1 U1.35(RAVDD18)
NetC412_2: C412.2 FB17.1 U1.59(TXVCCVCO33)
NetC413_2: C413.2 FB16.1 U1.58(TXPVDDPLL33A) U1.62(TXPVDDPLL33B) U1.63(TXVCCCHP33)
NetC414_1: C414.1 C415.2 R262.1 U1.60(TXVDDVCO18)
NetC416_1: C416.1 C419.2 R263.1
NetC417_2: C417.2 FB21.1 U1.81(RXPVDDPLL33B)
NetC418_2: C418.2 FB19.1 U1.78(RXVCCCHP33) U1.79(RXVCCLOB33) U1.82(RXVCCVCO33) U1.85(RXVCCPLL33) U1.86(RXPVDDPLL33A)
NetC421_2: C421.2 R264.1
NetC422_2: C422.2 FB22.1 U1.74(PVDDSPI33)
NetC423_1: C423.1 FB23.1 U1.37(TAVDD33)
NetC424_2: C424.2 R265.2 U1.34(PVDDAD33D)
NetC425_2: C425.2 FB24.1 U1.7(PVDDVGG)
NetFB18_1: FB18.1 R262.2
NetFB20_2: FB20.2 R263.2 U1.84(RXVDDVCO18)
NetR260_2: R260.2 U1.72(TRXVDDDSM18)
NetR261_2: R261.2 U1.73(VSPI18)

### Layout directives
net class LMS_PowerPin_Nets: GND, VCC_1V8_LM, VCC_1V8_RXLO_LM, VCC_1V8_TXLO_LM, VCC_3V3_LM

### Library data of the parts
C403-C410 C412-C414 C416-C418 C422 = C1005X5R0J104K: as C436 on sheet RF_Transmit; Part Number: C1005X5R0J104K
  C404-C410 C412-C414 C416-C418 C422: Tolerance: 10%
C411 C420 C421 C423-C425 = "MCCA000506": C 1 uF 10V 0402 X5R; Manufacturer: MULTICOMP; Tolerance: *; Part Number: "MCCA000506"; Footprint Ref: CAPC0402(1005)60_N; Library Ref: CAP_0402
C415 C419 = "MCCA000517": C 10 uF 6.3 V 0603 X5R; Manufacturer: Multicomp; Tolerance: *; Part Number: "MCCA000517"; Footprint Ref: CAPC0603(1608)100_N; Library Ref: CAP_0603
FB7-FB12 FB14-FB23 = "MMZ1005S601C": Ferrite 300mA 600ohm 0402; Manufacturer: TDK; Value: "0 Ohm"; R: *; Current: *; Part Number: "MMZ1005S601C"
FB13 FB24 = "MMZ1005S601C": Ferrite 300mA 600ohm 0402; Manufacturer: TDK; R: *; Current: *; Part Number: "MMZ1005S601C"; Footprint Ref: Inductor0402(1005); Library Ref: FerriteBead
R260 = ERJ-2RKF1500X: RES 150 OHM 1/10W 1% 0402 SMD; Manufacturer: Panasonic Electronic Components; Part Number: ERJ-2RKF1500X
R261 = ERJ-2RKF10R0X: RES 10.0 OHM 1/10W 1% 0402 SMD; Manufacturer: Panasonic Electronic Components; Part Number: ERJ-2RKF10R0X
R262 R263 = "RC0402JR-0722RL": R 22 Ohm 5% 63mW 0402; Manufacturer: YAGEO; Part Number: "RC0402JR-0722RL"; Footprint Ref: RESC0402(1005)_N; Library Ref: RES_0402
R264 R265 = ERJ-2RKF2700X: RES 270 OHM 1/10W 1% 0402 SMD; Manufacturer: Panasonic Electronic Components; Part Number: ERJ-2RKF2700X
U1 = LMS6002DFN: as U1 on sheet RF_Transceiver_LM6002D; Part Number: LMS6002DFN

## Sheet RF_Transceiver_LMS6002_PLL_CLK.SchDoc
size A4; DocumentNumber: 25; SheetNumber: 25; SheetTotal: 47
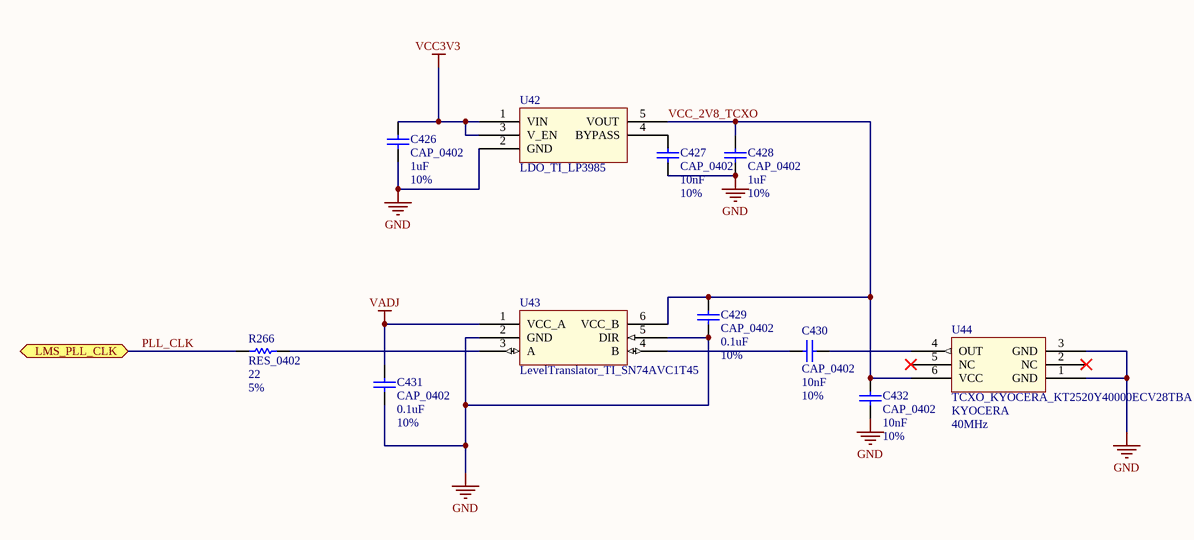
[diagram p29: RF_Transceiver_LMS6002_PLL_CLK.SchDoc]

### Parts
C426  CAP_0402  value 1uF  Tolerance: 10%  [CAPC0402(1005)60_N]
C427  CAP_0402  value 10nF  Tolerance: 10%  [CAPC0402(1005)60_N]
C428  CAP_0402  value 1uF  Tolerance: 10%  [CAPC0402(1005)60_N]
C429  CAP_0402  value 0.1uF  Tolerance: 10%  [CAPC0402(1005)60_N]
C430  CAP_0402  value 10nF  Tolerance: 10%  [CAPC0402(1005)60_N]
C431  CAP_0402  value 0.1uF  Tolerance: 10%  [CAPC0402(1005)60_N]
C432  CAP_0402  value 10nF  Tolerance: 10%  [CAPC0402(1005)60_N]
R266  RES_0402  value 22  Tolerance: 5%  [RESC0402(1005)_N]
U42  LDO_TI_LP3985  [LDO_TI_LP3985_SOT23-5]
U43  LevelTranslator_TI_SN74AVC1T45  [LevelTranslator_TI_SN74AVC1T45 _SC70-6]
U44  TCXO_KYOCERA_KT2520Y40000ECV28TBA  value 40MHz  Manufacturer: KYOCERA  [TCXO_KYOCERA_KT2520Y40000ECV28TBA_PCB-6PIN]

### Ports
LMS_PLL_CLK (bidir)

### Nets
GND: C426.1 C427.1 C428.1 C429.1 C431.2 C432.1 U42.2(GND) U43.2(GND) U43.5(DIR) U44.1(GND) U44.3(GND)
VADJ: C431.1 U43.1(VCC_A)
VCC3V3: C426.2 U42.1(VIN) U42.3(V_EN)
PLL_CLK: R266.1 ; port LMS_PLL_CLK
VCC_2V8_TCXO: C428.2 C429.2 C432.2 U42.5(VOUT) U43.6(VCC_B) U44.6(VCC)
NetC427_2: C427.2 U42.4(BYPASS)
NetC430_1: C430.1 U43.4(B)
NetC430_2: C430.2 U44.4(OUT)
NetR266_2: R266.2 U43.3(A)

Not connected (* = marked no-connect by the designer): U44 2(NC)* 5(NC)*

### Library data of the parts
C426 C428 = C1005X5R0J105K: 1uF, ceramic, 10%, 6.3V, X5R, 0402; Manufacturer: TDK Corporation; Part Number: C1005X5R0J105K; Footprint Ref: CAPC0402(1005)60_N; Library Ref: CAP_0402
C427 C430 C432 = GRM155R60J103KA01D: as C485 on sheet Temperature_Sensors; Part Number: GRM155R60J103KA01D; Footprint Ref: CAPC0402(1005)60_N; Library Ref: CAP_0402
C429 C431 = C1005X5R0J104K: as C436 on sheet RF_Transmit; Part Number: C1005X5R0J104K; Footprint Ref: CAPC0402(1005)60_N; Library Ref: CAP_0402
R266 = ERJ-2GEJ220X: RES 22 OHM 1/10W 5% 0402 SMD; Manufacturer: Panasonic Electronic Components; Part Number: ERJ-2GEJ220X; Footprint Ref: RESC0402(1005)_N; Library Ref: RES_0402
U42 = LP3985IM5-2.8/NOPB: LDO_TI_LP3985,150mA,CMOS, IC REG LDO 2.8V .15A SOT-23-5; Manufacturer: Texas Instruments; Part Number: LP3985IM5-2.8/NOPB
U43 = SN74AVC1T45DCKR: Level Translator, IC BUS TRANSCVR TRI-ST SC70-6; Manufacturer: Texas Instruments; Part Number: SN74AVC1T45DCKR
U44 = KT2520Y40000ECV28TBA: TCXO_KYOCERA_KT2520Y40000ECV28TBA,40MHz,2.8V; Part Number: KT2520Y40000ECV28TBA; Footprint Ref: TCXO_KYOCERA_KT2520Y40000ECV28TBA_PCB-6PIN; Library Ref: TCXO_KYOCERA_KT2520Y40000ECV28TBA